# EAGLE design Electric+Scheme (EAGLE 9.7.0)
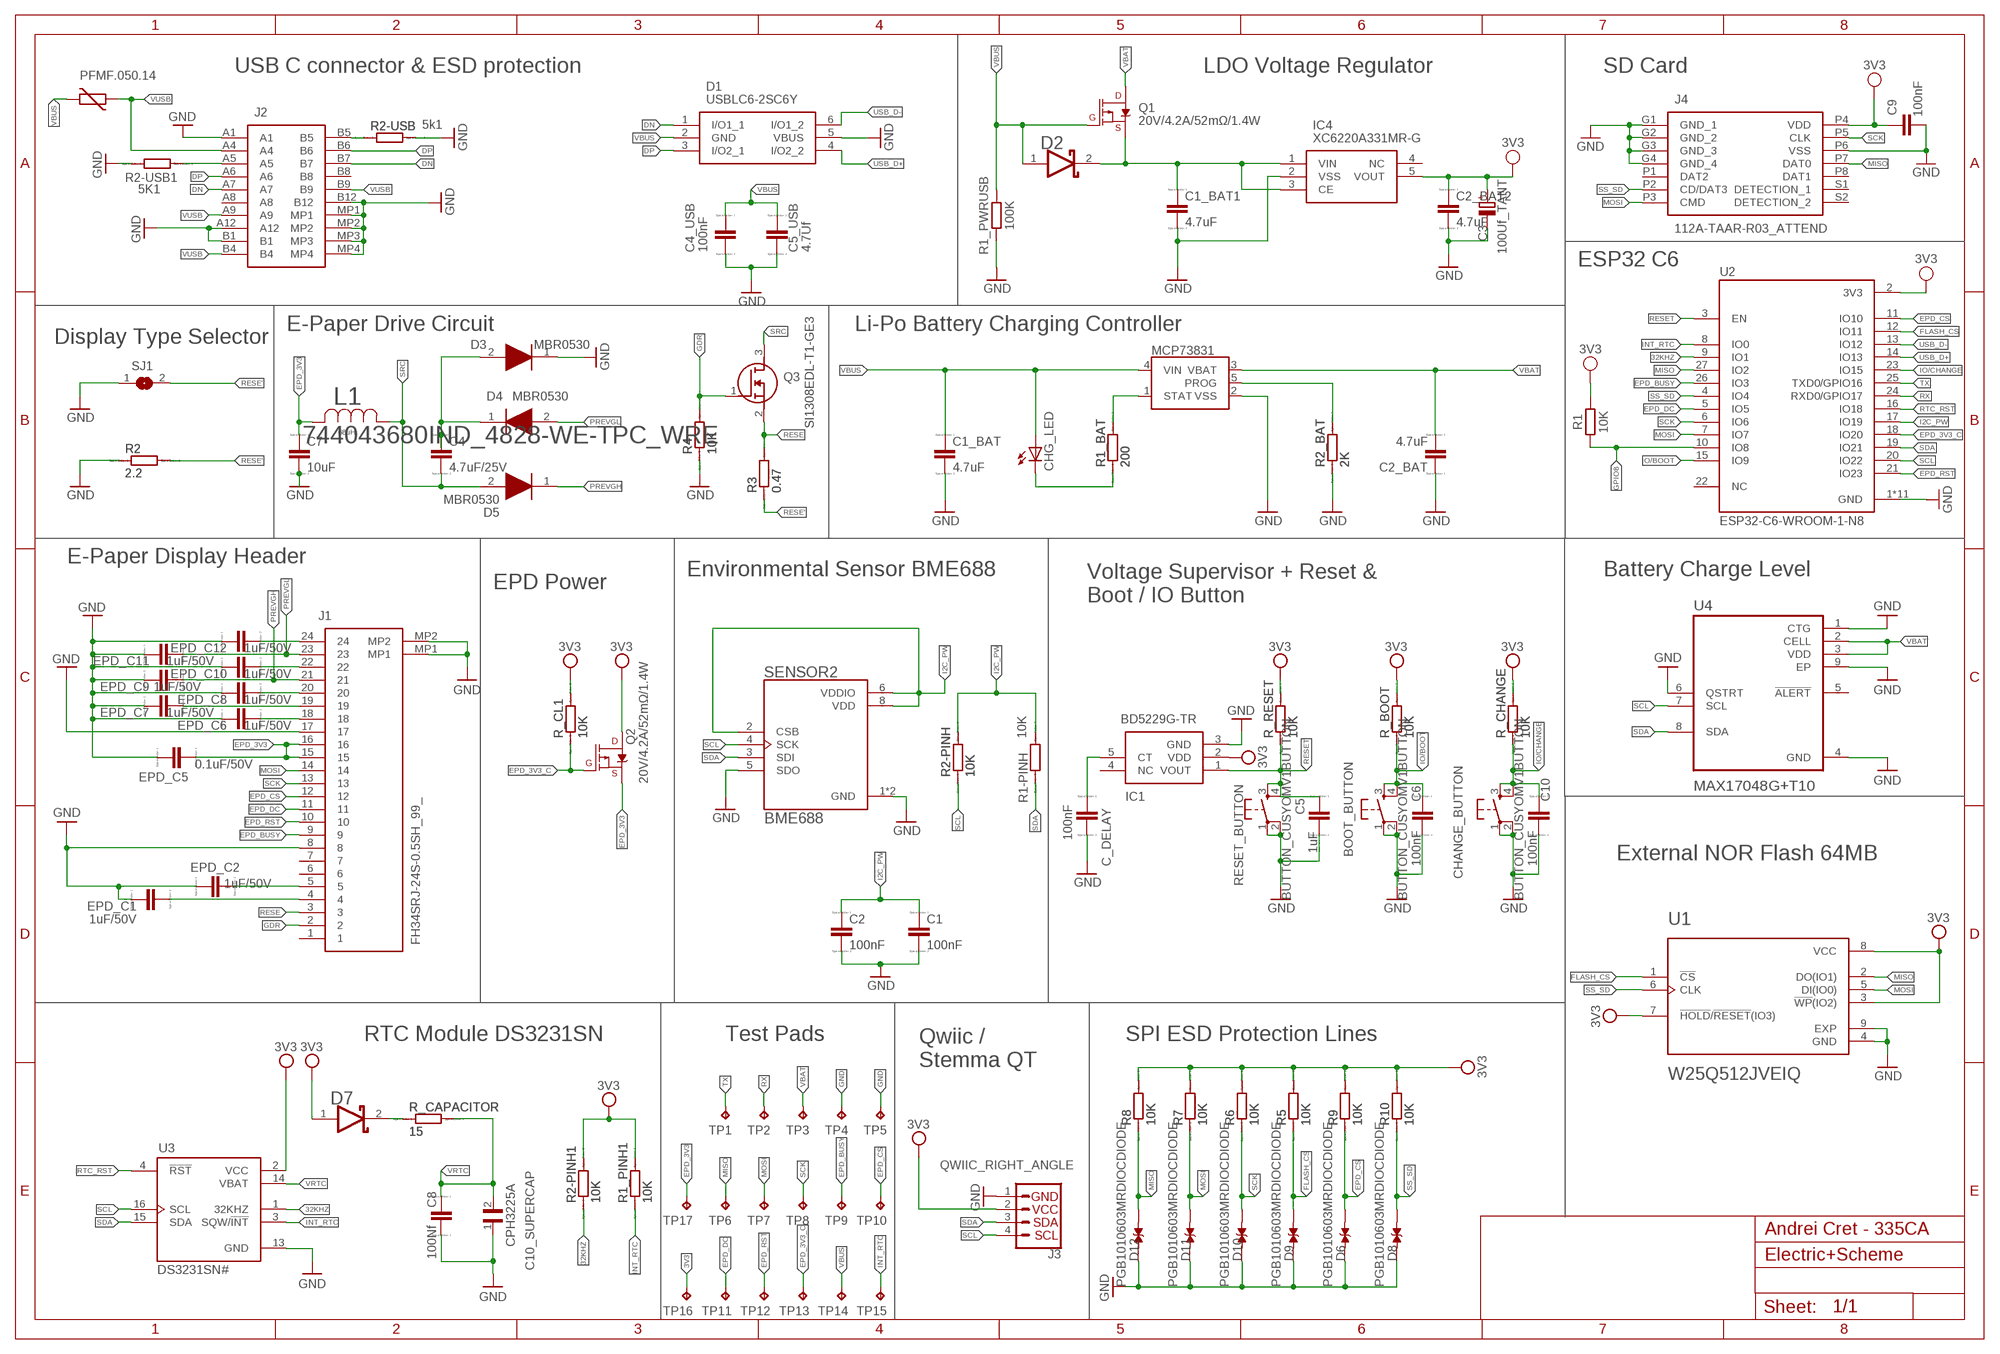
[diagram p0: schematic, sheet 1]

## Parts
BOOT_BUTTON  BUTTON_CUSYOMV1BUTTON  [MYBUTTON]
C1  100nF  EAGLE-LTSPICE_C  [EAGLE-LTSPICE_C0402]
C1_BAT  4.7uF  EAGLE-LTSPICE_C  [EAGLE-LTSPICE_C0402]
C1_BAT1  4.7uF  EAGLE-LTSPICE_C  [EAGLE-LTSPICE_C0402]
C2  100nF  EAGLE-LTSPICE_C  [EAGLE-LTSPICE_C0402]
C2_BAT  4.7uF  EAGLE-LTSPICE_C  [EAGLE-LTSPICE_C0402]
C2_BAT2  4.7uF  EAGLE-LTSPICE_C  [EAGLE-LTSPICE_C0402]
C3  100Uf_TANT  CAPACITOR-POL_TANTALUM-1206(3216-METRIC)  [CAPMP3216X180N]
C4  4.7uF/25V  EAGLE-LTSPICE_C  [EAGLE-LTSPICE_C0402]
C4_USB  100nF  EAGLE-LTSPICE_C  [EAGLE-LTSPICE_C0402]
C5  1uF  EAGLE-LTSPICE_C  [EAGLE-LTSPICE_C0402]
C5_USB  4.7Uf  EAGLE-LTSPICE_C  [EAGLE-LTSPICE_C0402]
C6  100nF  EAGLE-LTSPICE_C  [EAGLE-LTSPICE_C0402]
C7  10uF  EAGLE-LTSPICE_C  [EAGLE-LTSPICE_C0402]
C8  100Nf  ESP32_WROVER_EAGLE-LTSPICE_C  [ESP32_WROVER_EAGLE-LTSPICE_C0402]
C9  100nF  CAPACITOR_CHIP-0402(1005-METRIC)  [CAPC1005X60]
C10  100nF  EAGLE-LTSPICE_C  [EAGLE-LTSPICE_C0402]
C10_SUPERCAP  CPH3225A  [CAPCP3225X100N]
C_DELAY  100nF  EAGLE-LTSPICE_C  [EAGLE-LTSPICE_C0402]
CHANGE_BUTTON  BUTTON_CUSYOMV1BUTTON  [MYBUTTON]
CHG_LED  RED  ADAFRUIT_LEDCHIP-LED0603  [ADAFRUIT_CHIP-LED0603]
D1  USBLC6-2SC6Y  [SOT95P280X145-6N]
D2  ESP32_WROVER_AVX---SD0805S020S1R0_AVX_SD0805S020S1R0_0_0  [ESP32_WROVER_AVX---SD0805S020S1R0_AVX_SD0805S020S1R0_0]
D3  MBR0530  [SOD3716X135N]
D4  MBR0530  [SOD3716X135N]
D5  MBR0530  [SOD3716X135N]
D6  PGB1010603MRDIOCDIODE  [DIOC1608X36N]
D7  ESP32_WROVER_AVX---SD0805S020S1R0_AVX_SD0805S020S1R0_0_0  [ESP32_WROVER_AVX---SD0805S020S1R0_AVX_SD0805S020S1R0_0]
D8  PGB1010603MRDIOCDIODE  [DIOC1608X36N]
D9  PGB1010603MRDIOCDIODE  [DIOC1608X36N]
D10  PGB1010603MRDIOCDIODE  [DIOC1608X36N]
D11  PGB1010603MRDIOCDIODE  [DIOC1608X36N]
D12  PGB1010603MRDIOCDIODE  [DIOC1608X36N]
EPD_C1  1uF/50V  ESP32_WROVER_EAGLE-LTSPICE_C  [ESP32_WROVER_EAGLE-LTSPICE_C0402]
EPD_C2  1uF/50V  ESP32_WROVER_EAGLE-LTSPICE_C  [ESP32_WROVER_EAGLE-LTSPICE_C0402]
EPD_C5  0.1uF/50V  EAGLE-LTSPICE_C  [EAGLE-LTSPICE_C0402]
EPD_C6  1uF/50V  EAGLE-LTSPICE_C  [EAGLE-LTSPICE_C0402]
EPD_C7  1uF/50V  EAGLE-LTSPICE_C  [EAGLE-LTSPICE_C0402]
EPD_C8  1uF/50V  EAGLE-LTSPICE_C  [EAGLE-LTSPICE_C0402]
EPD_C9  1uF/50V  EAGLE-LTSPICE_C  [EAGLE-LTSPICE_C0402]
EPD_C10  1uF/50V  EAGLE-LTSPICE_C  [EAGLE-LTSPICE_C0402]
EPD_C11  1uF/50V  EAGLE-LTSPICE_C  [EAGLE-LTSPICE_C0402]
EPD_C12  1uF/50V  EAGLE-LTSPICE_C  [EAGLE-LTSPICE_C0402]
IC1  BD5229G-TR  [SOT95P280X125-5N]
IC4  XC6220A331MR-G  [SOT95P280X120-5N]
J1  FH34SRJ-24S-0.5SH_99_  [FH34SRJ24S05SH99]
J2  SAMACSYS_PARTS_USB4110-GF-A  [SAMACSYS_PARTS_USB4110GFA]
J3  QWIIC_RIGHT_ANGLE  QWIIC_CONNECTORJS-1MM  [JST04_1MM_RA]
J4  112A-TAAR-R03_ATTEND  [112ATAARR03ATTEND]
L1  744043680IND_4828-WE-TPC_WRE  [IND_4828-WE-TPC_WRE]
MCP73831  ESP32_WROVER_SPARKFUN-IC-POWER_MCP73831  [ESP32_WROVER_SPARKFUN-IC-POWER_SOT23-5]
PFMF.050.14  ESP32C6_VARISTORCN1812  [ESP32C6_VARISTOR_CT/CN1812]
Q1  20V/4.2A/52mΩ/1.4W  ESP32_WROVER_SPARKFUN-DISCRETESEMI_MOSFET_PCH-DMG2305UX-7  [ESP32_WROVER_SPARKFUN-DISCRETESEMI_SOT23-3]
Q2  20V/4.2A/52mΩ/1.4W  ESP32_WROVER_SPARKFUN-DISCRETESEMI_MOSFET_PCH-DMG2305UX-7  [ESP32_WROVER_SPARKFUN-DISCRETESEMI_SOT23-3]
Q3  SI1308EDL-T1-GE3  [SOT65P210X110-3N]
R1  10K  RESISTOR__CHIP-0402(1005-METRIC)  [RESC1005X40]
R1-PINH  10K  ESP32_WROVER_EAGLE-LTSPICE_R  [ESP32_WROVER_EAGLE-LTSPICE_R0402]
R1_BAT  200  ESP32_WROVER_EAGLE-LTSPICE_R  [ESP32_WROVER_EAGLE-LTSPICE_R0402]
R1_PINH1  10K  ESP32_WROVER_EAGLE-LTSPICE_R  [ESP32_WROVER_EAGLE-LTSPICE_R0402]
R1_PWRUSB  100K  RESISTOR__CHIP-0402(1005-METRIC)  [RESC1005X40]
R2  2.2  ESP32_WROVER_EAGLE-LTSPICE_R  [ESP32_WROVER_EAGLE-LTSPICE_R0402]
R2-PINH  10K  ESP32_WROVER_EAGLE-LTSPICE_R  [ESP32_WROVER_EAGLE-LTSPICE_R0402]
R2-PINH1  10K  ESP32_WROVER_EAGLE-LTSPICE_R  [ESP32_WROVER_EAGLE-LTSPICE_R0402]
R2-USB  5k1  ESP32_WROVER_EAGLE-LTSPICE_R  [ESP32_WROVER_EAGLE-LTSPICE_R0402]
R2-USB1  5K1  ESP32_WROVER_EAGLE-LTSPICE_R  [ESP32_WROVER_EAGLE-LTSPICE_R0402]
R2_BAT  2K  ESP32_WROVER_EAGLE-LTSPICE_R  [ESP32_WROVER_EAGLE-LTSPICE_R0402]
R3  0.47  ESP32_WROVER_EAGLE-LTSPICE_R  [ESP32_WROVER_EAGLE-LTSPICE_R0402]
R4  10K  ESP32_WROVER_EAGLE-LTSPICE_R  [ESP32_WROVER_EAGLE-LTSPICE_R0402]
R5  10K  ESP32_WROVER_EAGLE-LTSPICE_R  [ESP32_WROVER_EAGLE-LTSPICE_R0402]
R6  10K  ESP32_WROVER_EAGLE-LTSPICE_R  [ESP32_WROVER_EAGLE-LTSPICE_R0402]
R7  10K  ESP32_WROVER_EAGLE-LTSPICE_R  [ESP32_WROVER_EAGLE-LTSPICE_R0402]
R8  10K  ESP32_WROVER_EAGLE-LTSPICE_R  [ESP32_WROVER_EAGLE-LTSPICE_R0402]
R9  10K  ESP32_WROVER_EAGLE-LTSPICE_R  [ESP32_WROVER_EAGLE-LTSPICE_R0402]
R10  10K  ESP32_WROVER_EAGLE-LTSPICE_R  [ESP32_WROVER_EAGLE-LTSPICE_R0402]
R_BOOT  10K  ESP32_WROVER_EAGLE-LTSPICE_R  [ESP32_WROVER_EAGLE-LTSPICE_R0402]
R_CAPACITOR  15  ESP32_WROVER_EAGLE-LTSPICE_R  [ESP32_WROVER_EAGLE-LTSPICE_R0402]
R_CHANGE  10K  ESP32_WROVER_EAGLE-LTSPICE_R  [ESP32_WROVER_EAGLE-LTSPICE_R0402]
R_CL1  10K  ESP32_WROVER_EAGLE-LTSPICE_R  [ESP32_WROVER_EAGLE-LTSPICE_R0402]
R_RESET  10K  ESP32_WROVER_EAGLE-LTSPICE_R  [ESP32_WROVER_EAGLE-LTSPICE_R0402]
RESET_BUTTON  BUTTON_CUSYOMV1BUTTON  [MYBUTTON]
SENSOR2  BME688  ESP32_WROVER_BME680_BME680  [ESP32_WROVER_BME680_PSON80P300X300X100-8N]
SJ1  SOLDERJUMPER  SJ  [SJ]
TP1  TP  [TP20R]
TP2  TP  [TP20R]
TP3  TP  [TP20R]
TP4  TP  [TP20R]
TP5  TP  [TP20R]
TP6  TP  [TP20R]
TP7  TP  [TP20R]
TP8  TP  [TP20R]
TP9  TP  [TP20R]
TP10  TP  [TP20R]
TP11  TP  [TP20R]
TP12  TP  [TP20R]
TP13  TP  [TP20R]
TP14  TP  [TP20R]
TP15  TP  [TP20R]
TP16  TP  [TP20R]
TP17  TP  [TP20R]
U1  W25Q512JVEIQ  [SON127P600X800X80-9N]
U2  ESP32-C6-WROOM-1-N8  [XCVR_ESP32-C6-WROOM-1-N8]
U3  DS3231SN#  [SOIC127P1032X265-16N]
U4  MAX17048G+T10  [SON50P200X200X80-9N]

## Nets
3V3 [0.3]: C2_BAT2.1 C3.1(+) C9.2 D7.1(ANODE) IC1.2(VDD) IC4.5(VOUT) J3.2 J4.P4(VDD) Q2.3(D) R1.2 R1_PINH1.2 R2-PINH1.2 R5.2 R6.2 R7.2 R8.2 R9.2 R10.2 R_BOOT.2 R_CHANGE.2 R_CL1.2 R_RESET.2 TP16.TP U1.3(!WP!(IO2)) U1.7(!HOLD!/!RESET!(IO3)) U1.8(VCC) U2.2(3V3) U3.2(VCC)
32KHZ: R2-PINH1.1 U2.9(IO1) U3.1(32KHZ)
DN: D1.1(I/O1_1) J2.A7 J2.B7
DP: D1.3(I/O2_1) J2.A6 J2.B6
EPD_3V3 [0.3]: C7.1 EPD_C5.2 J1.15 J1.16 L1.2 Q2.2(S) TP17.TP
EPD_3V3_C [0.3]: Q2.1(G) R_CL1.1 TP13.TP U2.18(IO20)
EPD_BUSY: J1.9 TP9.TP U2.26(IO3)
EPD_CS: D6.2 J1.12 R9.1 TP10.TP U2.11(IO10)
EPD_DC: J1.11 TP11.TP U2.5(IO5)
EPD_RST: J1.10 TP12.TP U2.21(IO23)
FLASH_CS: D9.2 R5.1 U1.1(!CS) U2.12(IO11)
GDR [0.3]: J1.2 Q3.1(G) R4.2
GND [0.3]: BOOT_BUTTON.1 BOOT_BUTTON.2 C1.2 C1_BAT1.2 C1_BAT.2 C2.2 C2_BAT2.2 C2_BAT.1 C3.2(-) C4_USB.2 C5.2 C5_USB.2 C6.2 C7.2 C8.2 C9.1 C10.2 C10_SUPERCAP.1 C_DELAY.2 CHANGE_BUTTON.1 CHANGE_BUTTON.2 D1.5(VBUS) D3.1(K) D6.1 D8.1 D9.1 D10.1 D11.1 D12.1 EPD_C1.1 EPD_C2.1 EPD_C5.1 EPD_C6.1 EPD_C7.1 EPD_C8.1 EPD_C9.1 EPD_C10.1 EPD_C11.1 EPD_C12.1 IC1.3(GND) IC4.2(VSS) J1.8 J1.17 J1.MP1 J1.MP2 J2.A1 J2.A12 J2.B1 J2.B12 J2.MP1 J2.MP2 J2.MP3 J2.MP4 J3.1 J4.G1(GND_1) J4.G2(GND_2) J4.G3(GND_3) J4.G4(GND_4) J4.P6(VSS) MCP73831.2(VSS) R1_PWRUSB.1 R2-USB1.1 R2-USB.2 R2.1 R2_BAT.1 R4.1 RESET_BUTTON.1 RESET_BUTTON.2 SENSOR2.1(GND) SENSOR2.5(SDO) SENSOR2.7(GND) SJ1.1 TP4.TP TP5.TP U1.4(GND) U1.9(EXP) U2.1(GND) U2.28(GND) U2.29_1(GND) U2.29_2(GND) U2.29_3(GND) U2.29_4(GND) U2.29_5(GND) U2.29_6(GND) U2.29_7(GND) U2.29_8(GND) U2.29_9(GND) U3.13(GND) U4.1(CTG) U4.4(GND) U4.6(QSTRT) U4.9(EP)
GPIO8: R1.1 U2.10(IO8)
I2C_PW [0.3]: C1.1 C2.1 R1-PINH.2 R2-PINH.2 SENSOR2.2(CSB) SENSOR2.6(VDDIO) SENSOR2.8(VDD) U2.17(IO19)
INT_RTC: R1_PINH1.1 TP15.TP U2.8(IO0) U3.3(SQW/!INT)
IO/BOOT: BOOT_BUTTON.3 BOOT_BUTTON.4 C6.1 R_BOOT.1 U2.15(IO9)
IO/CHANGE: C10.1 CHANGE_BUTTON.3 CHANGE_BUTTON.4 R_CHANGE.1 U2.23(IO15)
MISO: D12.2 J4.P7(DAT0) R8.1 TP6.TP U1.2(DO(IO1)) U2.27(IO2)
MOSI: D11.2 J1.14 J4.P3(CMD) R7.1 TP7.TP U1.5(DI(IO0)) U2.7(IO7)
N$1: C1_BAT1.1 D2.2(CATHODE) IC4.1(VIN) IC4.3(CE) Q1.2(S)
N$3: C4.1 D3.2(A) D4.1(K)
N$4: J2.B5 R2-USB.1
N$5: MCP73831.1(STAT) R1_BAT.2
N$6: CHG_LED.C R1_BAT.1
N$8: MCP73831.5(PROG) R2_BAT.2
N$9: D7.2(CATHODE) R_CAPACITOR.1
N$10: J2.A5 R2-USB1.2
N$11: EPD_C2.2 J1.5
N$12: EPD_C1.2 J1.4
N$13: D8.2 R10.1
N$14: C_DELAY.1 IC1.5(CT)
N$15 [0.3]: EPD_C12.2 J1.24
N$16: EPD_C6.2 J1.18
N$17: EPD_C7.2 J1.19
N$18: EPD_C10.2 J1.22
N$20: EPD_C8.2 J1.20
PREVGH: D5.1(K) EPD_C9.2 J1.21
PREVGL [0.3]: D4.2(A) EPD_C11.2 J1.23
RESE: J1.3 Q3.2(S) R3.2
RESE': R2.2 R3.1 SJ1.2
RESET: C5.1 IC1.1(VOUT) R_RESET.1 RESET_BUTTON.3 RESET_BUTTON.4 U2.3(EN)
RTC_RST: U2.16(IO18) U3.4(!RST)
RX: TP2.TP U2.24(RXD0/GPIO17)
SCK: D10.2 J1.13 J4.P5(CLK) R6.1 TP8.TP U2.6(IO6)
SCL: J3.4 R2-PINH.1 SENSOR2.4(SCK) U2.20(IO22) U3.16(SCL) U4.7(SCL)
SDA: J3.3 R1-PINH.1 SENSOR2.3(SDI) U2.19(IO21) U3.15(SDA) U4.8(SDA)
SRC: C4.2 D5.2(A) L1.1 Q3.3(D)
SS_SD: J4.P2(CD/DAT3) U1.6(CLK) U2.4(IO4)
TX: TP1.TP U2.25(TXD0/GPIO16)
USB_D+: D1.4(I/O2_2) U2.14(IO13)
USB_D-: D1.6(I/O1_2) U2.13(IO12)
VBAT [0.3]: C2_BAT.2 MCP73831.3(VBAT) Q1.3(D) TP3.TP U4.2(CELL) U4.3(VDD)
VBUS [0.3]: C1_BAT.1 C4_USB.1 C5_USB.1 CHG_LED.A D1.2(GND) D2.1(ANODE) MCP73831.4(VIN) PFMF.050.14.2 Q1.1(G) R1_PWRUSB.2 TP14.TP
VRTC: C8.1 C10_SUPERCAP.2 R_CAPACITOR.2 U3.14(VBAT)
VUSB [0.3]: J2.A4 J2.A9 J2.B4 J2.B9 PFMF.050.14.1
Unconnected: IC1.4(NC) IC4.4(NC) J1.1 J1.6 J1.7 J2.A8 J2.B8 J4.P1(DAT2) J4.P8(DAT1) J4.S1(DETECTION_1) J4.S2(DETECTION_2) U2.22(NC) U4.5(!ALERT)

## Notes on the sheet
- USB C connector & ESD protection | LDO Voltage Regulator | SD Card
- ESP32 C6
- E-Paper Drive Circuit | Li-Po Battery Charging Controller
- Display Type Selector
- E-Paper Display Header
- Environmental Sensor BME688 | Battery Charge Level
- EPD Power
- Voltage Supervisor + Reset & 
  Boot / IO Button
- External NOR Flash 64MB
- RTC Module DS3231SN | Test Pads | SPI ESD Protection Lines
- Qwiic /
  Stemma QT
- Andrei Cret - 335CA

## Library data of the parts
BOOT_BUTTON CHANGE_BUTTON RESET_BUTTON = DeskAssistant v19 v1:BUTTON_CUSYOMV1
C1 C1_BAT C1_BAT1 C2 C2_BAT C2_BAT2 C4 C4_USB C5 C5_USB C6 C7 C10 C_DELAY EPD_C5-EPD_C12 = DeskAssistant v19 v1:EAGLE-LTSPICE_C: CAPACITOR, European symbol
C3 = Tinkercad:CAPACITOR-POL: Capacitor Polarised - Generic; CATEGORY: Capacitor
C8 EPD_C1 EPD_C2 = DeskAssistant v19 v1:ESP32_WROVER_EAGLE-LTSPICE_C: CAPACITOR, European symbol
C9 = Tinkercad:CAPACITOR: Capacitor - Generic; CATEGORY: Capacitor
C10_SUPERCAP = DeskAssistant v19 v1:CPH3225A: Cap 0.011F 3.3V 1210 Flat Check availability <https://pricing.snapeda.com/parts/CPH3225A/Seiko%20Instruments/view-part?ref=eda>; AVAILABILITY: Not in stock; CHECK_PRICES: https://www.snapeda.com/parts/CPH3225A/Seiko+Instruments/view-part/?ref=eda; DESCRIPTION: 11 mF (EDLC) Supercapacitor 3.3 V 1210 (3225 Metric) - -; MF: Seiko Instruments; MP: CPH3225A; PACKAGE: 1210 Seiko; PRICE: None; PURCHASE-URL: https://www.snapeda.com/api/url_track_click_mouser/?unipart_id=562593&manufacturer=Seiko Instruments&part_name=CPH3225A&search_term=None; SNAPEDA_LINK: https://www.snapeda.com/parts/CPH3225A/Seiko+Instruments/view-part/?ref=snap
CHG_LED = DeskAssistant v19 v1:ADAFRUIT_LED: LED OSRAM: - CHIPLED LG R971, LG N971, LY N971, LG Q971, LY Q971, LO R971, LY R971 LH N974, LH R974 LS Q976, LO Q976, LY Q976 LO Q996 - Hyper CHIPLED LW Q18S LB Q993, LB Q99A, LB R99A - SideLED LS A670, LO A670, LY A670, LG A670, LP A670 LB A673, LV A673, LT A673, LW A673 LH A674 LY A675 LS A676, LA A676, LO A676, LY A676, LW A676 LS A679, LY A679, LG A679 - Hyper Micro SIDELED® LS Y876, LA Y876, LO Y876, LY Y876 LT Y87S - SmartLED LW L88C, LW L88S LB L89C, LB L89S, LG L890 LS L89K, LO L89K, LY L89K LS L896, LA L896, LO L896, LY L896 - TOPLED LS T670, LO T670, LY T670, LG T670, LP T670 LSG T670, LSP T670, LSY T670, LOP T670, LYG T670 LG T671, LOG T671, LSG T671 LB T673, LV T673, LT T673, LW T673 LH T674 LS T676, LA T676, LO T676, LY T676, LB T676, LH T676, LSB T676, LW T676 LB T67C, LV T67C, LT T67C, LS T67K, LO T67K, LY T67K, LW E67C LS E67B, LA E67B, LO E67B, LY E67B, LB E67C, LV E67C, LT E67C LW T67C LS T679, LY T679, LG T679 LS T770, LO T770, LY T770, LG T770, LP T770 LB T773, LV T773, LT T773, LW T773 LH T774 LS E675, LA E675, LY E675, LS T675 LS T776, LA T776, LO T776, LY T776, LB T776 LHGB T686 LT T68C, LB T68C - Hyper Mini TOPLED® LB M676 - Mini TOPLED Santana® LG M470 LS M47K, LO M47K, LY M47K Source: http://www.osram.convergy.de/
D1 = DeskAssistant v19 v1:USBLC6-2SC6Y: Low Cap. ESD Protection Auto SOT-23-6 STMicroelectronics USBLC6-2SC6Y, Dual Uni-Directional TVS Diode Array, 6-Pin SOT-23 Source: Datasheet <https://componentsearchengine.com/Datasheets/1/USBLC6-2SC6Y.pdf> Check availability <https://pricing.snapeda.com/parts/USBLC6-2SC6Y/STMicroelectronics/view-part?ref=eda>; AVAILABILITY: In Stock; CHECK_PRICES: https://www.snapeda.com/parts/USBLC6-2SC6Y/STMicroelectronics/view-part/?ref=eda; DESCRIPTION: 17V Clamp 5A (8/20µs) Ipp Tvs Diode Surface Mount SOT-23-6; MF: STMicroelectronics; MP: USBLC6-2SC6Y; PACKAGE: SOT-23-6 STMicroelectronics; PRICE: None; SNAPEDA_LINK: https://www.snapeda.com/parts/USBLC6-2SC6Y/STMicroelectronics/view-part/?ref=snap
D2 D7 = DeskAssistant v19 v1:ESP32_WROVER_AVX---SD0805S020S1R0_AVX_SD0805S020S1R0_0_0: Schottky Barrier Rectifier Diode
D3-D5 = DeskAssistant v19 v1:MBR0530: ON SEMICONDUCTOR - MBR0530 - DIODE, SCHOTTKY, 0.5A, 30V, SOD-123 Source: Datasheet <http://www.onsemi.com/pub/Collateral/MBR0530T1-D.PDF> Check availability <https://pricing.snapeda.com/parts/MBR0530/ON%20Semiconductor/view-part?ref=eda>
D6 D8-D12 = DeskAssistant v19 v1:PGB1010603MR: Check availability <https://pricing.snapeda.com/parts/PGB1010603MR/Littelfuse%20Inc./view-part?ref=eda>
IC1 = DeskAssistant v19 v1:BD5229G-TR: Voltage Detector with Adjustable Delay Time: CMOS processes are utilized to develop high precision, low current consumption CMOS reset ICs that allow arbitrary setting of the delay time. The extensive lineup includes both Nch Open Drain and CMOS output types in a wide range of detection voltages (from 2.3V to 6.0V, in 0.1V steps), enabling selection of the ideal solution based on customer requirements. In addition, the entire series is of course both lead-free and RoHS-compliant. Source: Datasheet <https://datasheet.datasheetarchive.com/originals/distributors/Datasheets_SAMA/f2b9741ef86007909f138d561a359946.pdf>; DESCRIPTION: Voltage Detector with Adjustable Delay Time: CMOS processes are utilized to develop high precision, low current consumption CMOS reset ICs that allow arbitrary setting of the delay time. The extensive lineup includes both Nch Open Drain and CMOS output types in a wide range of detection voltages (from 2.3V to 6.0V, in 0.1V steps), enabling selection of the ideal solution based on customer requirements. In addition, the entire series is of course both lead-free and RoHS-compliant.; HEIGHT: 1.25mm; MANUFACTURER_NAME: ROHM Semiconductor; MANUFACTURER_PART_NUMBER: BD5229G-TR; MOUSER_PART_NUMBER: 755-BD5229G-TR; MOUSER_PRICE-STOCK: https://www.mouser.co.uk/ProductDetail/ROHM-Semiconductor/BD5229G-TR?qs=4kLU8WoGk0vvnhrrYwdszw%3D%3D
IC4 = DeskAssistant v19 v1:XC6220A331MR-G: LDO Voltage Regulators Source: Datasheet <https://www.torexsemi.com/file/xc6220/XC6220.pdf>; DESCRIPTION: LDO Voltage Regulators; HEIGHT: 1.2mm; MANUFACTURER_NAME: Torex; MANUFACTURER_PART_NUMBER: XC6220A331MR-G; MOUSER_PART_NUMBER: 865-XC6220A331MR-G; MOUSER_PRICE-STOCK: https://www.mouser.co.uk/ProductDetail/Torex-Semiconductor/XC6220A331MR-G?qs=AsjdqWjXhJ8ZSWznL1J0gg%3D%3D
J1 = DeskAssistant v19 v1:FH34SRJ-24S-0.5SH_99_: 24 Position FFC, FPC Connector Contacts, Top and Bottom 0.020" (0.50mm) Surface Mount, Right Angle Source: Datasheet <https://www.hirose.com/en/product/document?clcode=CL0580-1255-6-99&productname=FH34SRJ-24S-0.5SH(99)&series=FH34SRJ&documenttype=2DDrawing&lang=en&documentid=0000990903>; DESCRIPTION: 24 Position FFC, FPC Connector Contacts, Top and Bottom 0.020" (0.50mm) Surface Mount, Right Angle; HEIGHT: 1.1mm; MANUFACTURER_NAME: Hirose; MANUFACTURER_PART_NUMBER: FH34SRJ-24S-0.5SH(99); MOUSER_PART_NUMBER: 798-FH34SRJ24S05SH99; MOUSER_PRICE-STOCK: https://www.mouser.co.uk/ProductDetail/Hirose-Connector/FH34SRJ-24S-0.5SH99?qs=vcbW%252B4%252BSTIpKBl5ap9J8Fw%3D%3D
J2 = DeskAssistant v19 v1:SAMACSYS_PARTS_USB4110-GF-A: CONN USB 2.0 TYPE-C R/A SMT Source: Datasheet <https://gct.co/files/drawings/usb4110.pdf>; DESCRIPTION: CONN USB 2.0 TYPE-C R/A SMT; HEIGHT: 3.26mm; MANUFACTURER_NAME: GCT (GLOBAL CONNECTOR TECHNOLOGY); MANUFACTURER_PART_NUMBER: USB4110-GF-A; MOUSER_PART_NUMBER: 640-USB4110-GF-A; MOUSER_PRICE-STOCK: https://www.mouser.co.uk/ProductDetail/GCT/USB4110-GF-A?qs=KUoIvG%2F9IlYiZvIXQjyJeA%3D%3D
J3 = DeskAssistant v19 v1:QWIIC_CONNECTOR: SparkFun I2C Standard Qwiic Connector An SMD 1mm pitch JST connector makes it easy and quick (get it? Qwiic?) to connect I2C devices to each other. The Qwiic system <http://www.sparkfun.com/qwiic> enables fast and solderless connection between popular platforms and various sensors and actuators. We carry 200mm <https://www.sparkfun.com/products/14204>, 100mm <https://www.sparkfun.com/products/14205>, 50mm <https://www.sparkfun.com/products/14206>, and breadboard friendly <https://www.sparkfun.com/products/14207> Qwiic cables. We also offer 10 pcs strips <https://www.sparkfun.com/products/14323> the SMD connectors.; PROD_ID: CONN-13694
J4 = DeskAssistant v19 v1:112A-TAAR-R03_ATTEND: Micro SD Card Socket, Push-Push Type, Top Mount, SMT, H=1.83mm, 10u Source: Datasheet <https://www.attend.com.tw/data/download/file/112A-TAAR-R03.pdf>; DESCRIPTION: Micro SD Card Socket, Push-Push Type, Top Mount, SMT, H=1.83mm, 10u; HEIGHT: 1.9mm; MANUFACTURER_NAME: ATTEND; MANUFACTURER_PART_NUMBER: 112A-TAAR-R03 ATTEND
L1 = DeskAssistant v19 v1:744043680; COPYRIGHT: Copyright (C) 2024 Ultra Librarian. All rights reserved.; ETC: 68uH; MANUFACTURER_PART_NUMBER: 744043680; MFR_NAME: Wurth Electronics
MCP73831 = DeskAssistant v19 v1:ESP32_WROVER_SPARKFUN-IC-POWER_MCP73831: MCP73831T Li-Ion, Li-Pol Controller Miniature single cell, fully integrated Li-Ion, Li-polymer charge management controller Datasheet <http://ww1.microchip.com/downloads/en/DeviceDoc/20001984g.pdf> SparkFun Products: SparkFun ESP32 Thing <https://www.sparkfun.com/products/13907> SparkFun 9DoF Razor IMU M0 <https://www.sparkfun.com/products/14001>; PROD_ID: IC-09995
PFMF.050.14 = DeskAssistant v19 v1:ESP32C6_VARISTOR: VARISTOR
Q1 Q2 = DeskAssistant v19 v1:ESP32_WROVER_SPARKFUN-DISCRETESEMI_MOSFET_PCH: P-channel MOSFETs Voltage controlled devices that allow control of high current outputs. SparkFun Products: SparkFun ESP32 Thing <https://www.sparkfun.com/products/13907> SparkFun ESP8266 Thing <https://www.sparkfun.com/products/13231> SparkFun Pi Servo HAT V2 <https://www.sparkfun.com/products/15316> DMG2305UX-7 (20V/4.2A/SOT23-3); PROD_ID: TRAN-14388
Q3 = DeskAssistant v19 v1:SI1308EDL-T1-GE3: MOSFET N-Ch 30V 1.5A TrenchFET SC70 Vishay Si1308EDL-T1-GE3 N-channel MOSFET Transistor, 1.5 A, 30 V, 3-Pin SC-70 Source: Datasheet <https://componentsearchengine.com/Datasheets/1/SI1308EDL-T1-GE3.pdf> Check availability <https://pricing.snapeda.com/parts/SI1308EDL-T1-GE3/Vishay%20Siliconix/view-part?ref=eda>; AVAILABILITY: In Stock; CHECK_PRICES: https://www.snapeda.com/parts/SI1308EDL-T1-GE3/Vishay+Siliconix/view-part/?ref=eda; DESCRIPTION: Si1308EDL-T1-GE3 N-channel MOSFET Transistor, 1.5 A, 30 V, 3-Pin SC-70 | Siliconix / Vishay SI1308EDL-T1-GE3; MF: Vishay Siliconix; MP: SI1308EDL-T1-GE3; PACKAGE: SOT-323 Vishay Semiconductor; PRICE: None; PURCHASE-URL: https://www.snapeda.com/api/url_track_click_mouser/?unipart_id=274603&manufacturer=Vishay Siliconix&part_name=SI1308EDL-T1-GE3&search_term=None; SNAPEDA_LINK: https://www.snapeda.com/parts/SI1308EDL-T1-GE3/Vishay+Siliconix/view-part/?ref=snap
R1 R1_PWRUSB = Tinkercad:RESISTOR: Resistor Fixed - Generic; CATEGORY: Resistor; SUB-CATEGORY: Fixed
R1-PINH R1_BAT R1_PINH1 R2 R2-PINH R2-PINH1 R2-USB R2-USB1 R2_BAT R3-R10 R_BOOT R_CAPACITOR R_CHANGE R_CL1 R_RESET = DeskAssistant v19 v1:ESP32_WROVER_EAGLE-LTSPICE_R: RESISTOR, European symbol
SENSOR2 = DeskAssistant v19 v1:ESP32_WROVER_BME680_BME680: Integrated Environmental Unit; AVAILABILITY: Unavailable; DESCRIPTION: Integrated Environmental Unit; MF: Bosch Sensortec; MP: BME680; PACKAGE: LGA-8 Bosch Tools; PRICE: None
SJ1 = DeskAssistant v19 v1:SJ: SMD solder JUMPER
TP1-TP17 = DeskAssistant v19 v1:TP: Test pad
U1 = DeskAssistant v19 v1:W25Q512JVEIQ: Check availability <https://pricing.snapeda.com/parts/W25Q512JVEIQ/Winbond%20Electronics/view-part?ref=eda>; AVAILABILITY: In Stock; CHECK_PRICES: https://www.snapeda.com/parts/W25Q512JVEIQ/Winbond+Electronics/view-part/?ref=eda; DESCRIPTION: FLASH - NOR Memory IC 512Mb (64M x 8) SPI - Quad I/O 133 MHz 8-WSON (8x6); MF: Winbond Electronics; MP: W25Q512JVEIQ; PACKAGE: Package; PRICE: None; SNAPEDA_LINK: https://www.snapeda.com/parts/W25Q512JVEIQ/Winbond+Electronics/view-part/?ref=snap
U2 = DeskAssistant v19 v1:ESP32-C6-WROOM-1-N8: Check availability <https://pricing.snapeda.com/parts/ESP32-C6-WROOM-1-N8/Espressif%20Systems/view-part?ref=eda>; AVAILABILITY: In Stock; CHECK_PRICES: https://www.snapeda.com/parts/ESP32-C6-WROOM-1-N8/Espressif+Systems/view-part/?ref=eda; DESCRIPTION: Multiprotocol Modules ESP32-C6 module, Wi-Fi 6 in 2.4 GHz band, Bluetooth 5, Zigbee 3.0 and Thread. ESP34-WROOM Compatible - ENGINEERING SAMPLE; MF: Espressif Systems; MP: ESP32-C6-WROOM-1-N8; PACKAGE: None; PRICE: None; SNAPEDA_LINK: https://www.snapeda.com/parts/ESP32-C6-WROOM-1-N8/Espressif+Systems/view-part/?ref=snap
U3 = DeskAssistant v19 v1:DS3231SN#: Real Time Clock Serial 16-Pin SOIC W T/R Check availability <https://pricing.snapeda.com/parts/DS3231SN%23/Analog%20Devices/view-part?ref=eda>; AVAILABILITY: In Stock; CHECK_PRICES: https://www.snapeda.com/parts/DS3231SN%23/Analog+Devices/view-part/?ref=eda; DESCRIPTION: Extremely Accurate I²C-Integrated RTC/TCXO/Crystal; MF: Analog Devices; MP: DS3231SN#; PACKAGE: SOIC-16 Maxim; PRICE: None; PURCHASE-URL: https://www.snapeda.com/api/url_track_click_mouser/?unipart_id=99048&manufacturer=Analog Devices&part_name=DS3231SN#&search_term=None; SNAPEDA_LINK: https://www.snapeda.com/parts/DS3231SN%23/Analog+Devices/view-part/?ref=snap
U4 = DeskAssistant v19 v1:MAX17048G+T10: Check availability <https://pricing.snapeda.com/parts/MAX17048G%2BT10/Analog%20Devices/view-part?ref=eda>; AVAILABILITY: In Stock; CHECK_PRICES: https://www.snapeda.com/parts/MAX17048G+T10/Analog+Devices/view-part/?ref=eda; DESCRIPTION: 3µA 1-Cell/2-Cell Fuel Gauge with ModelGauge; MF: Analog Devices; MP: MAX17048G+T10; PACKAGE: TDFN-8 Maxim; PRICE: None; PURCHASE-URL: https://www.snapeda.com/api/url_track_click_mouser/?unipart_id=329239&manufacturer=Analog Devices&part_name=MAX17048G+T10&search_term=None; SNAPEDA_LINK: https://www.snapeda.com/parts/MAX17048G+T10/Analog+Devices/view-part/?ref=snap

## Net classes
1 0.3: width 0.3 mm

## Board
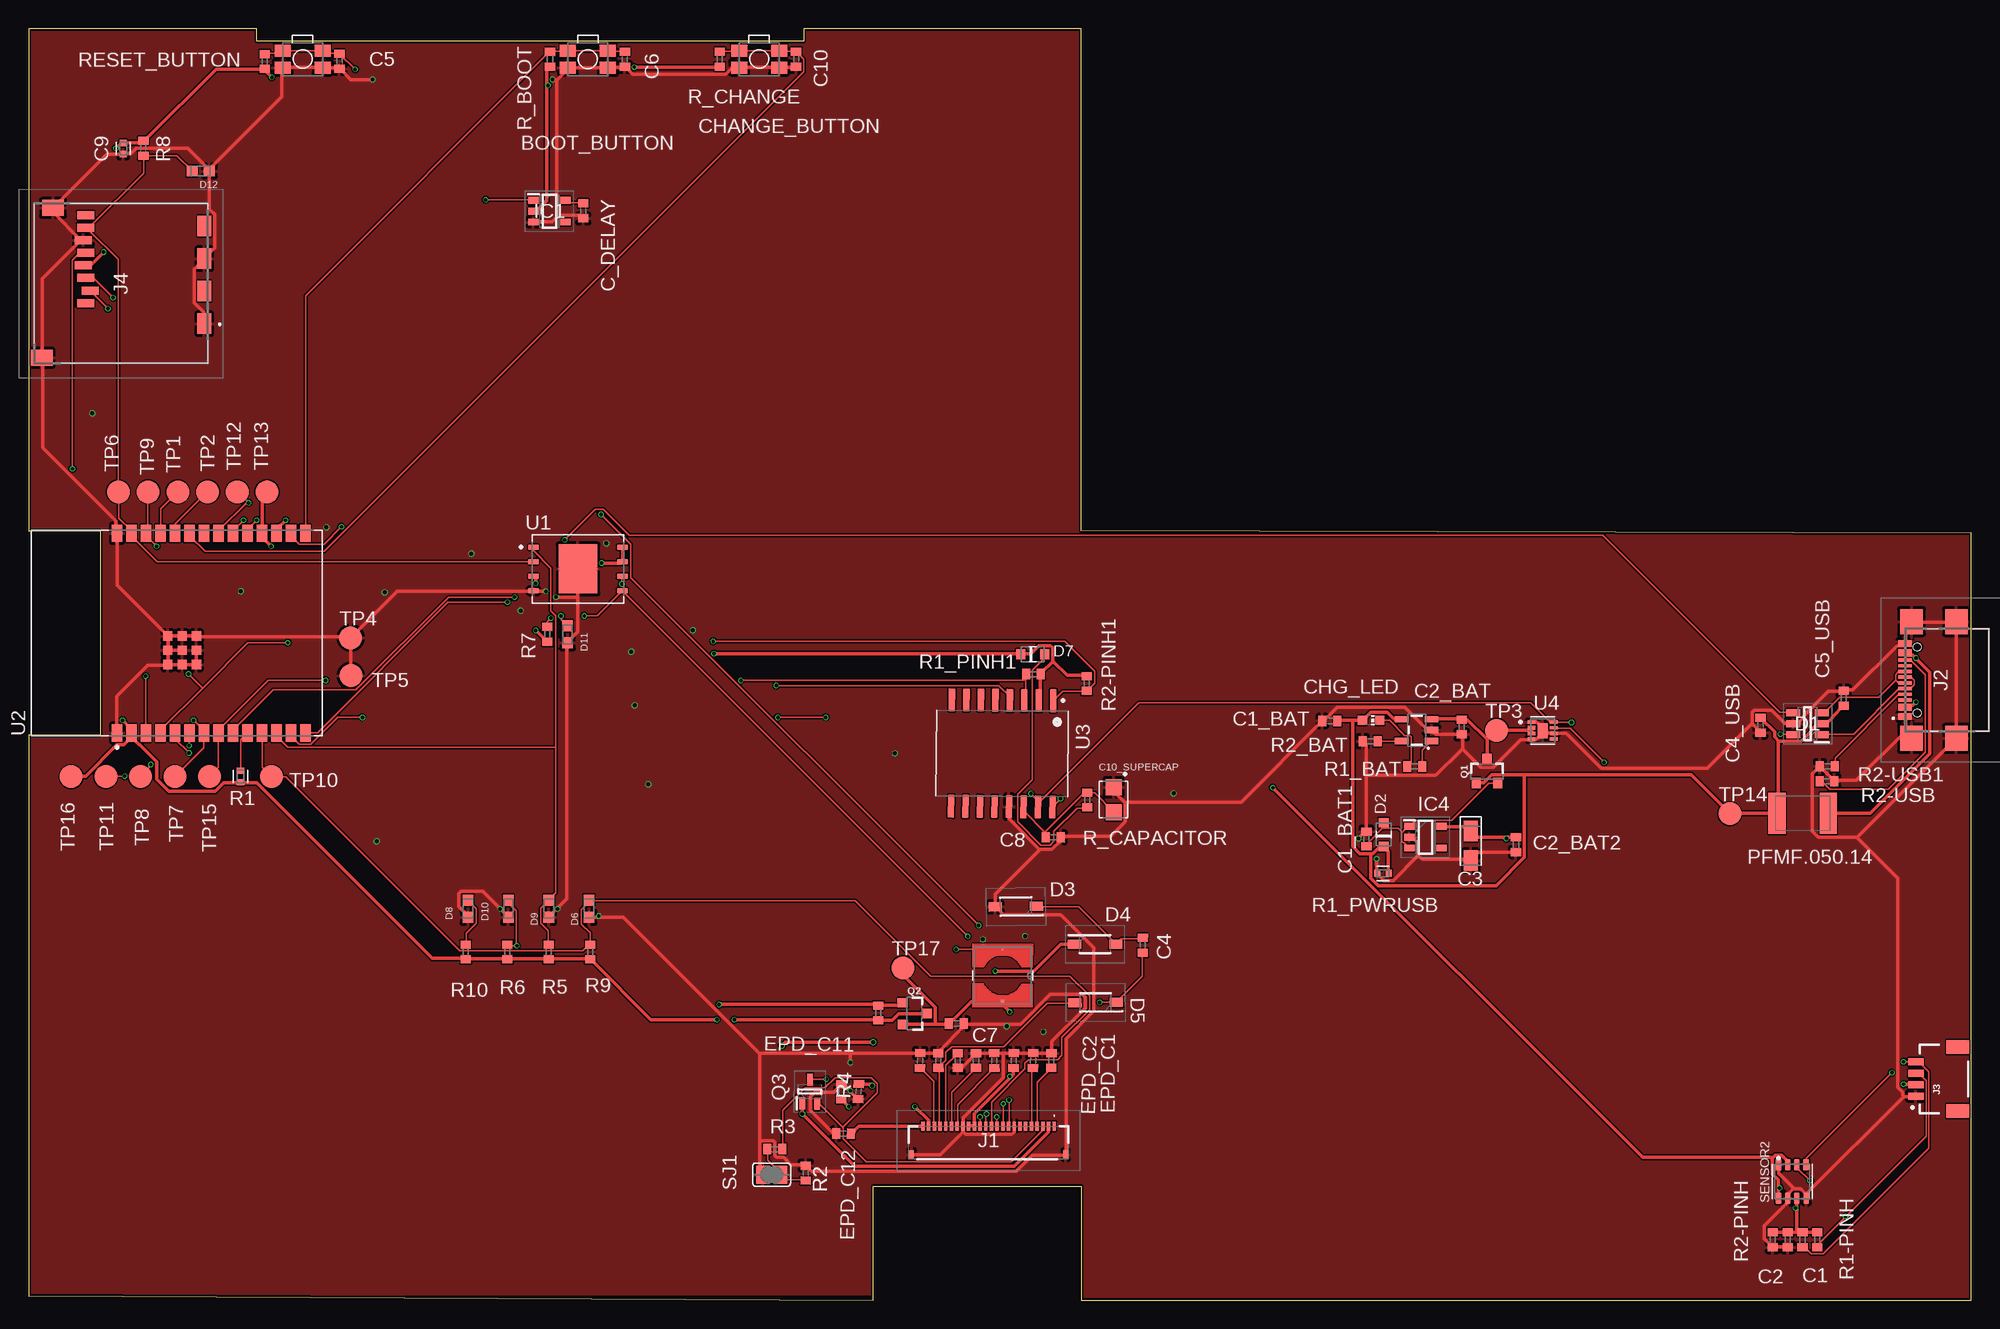
[diagram p1: board, top side]
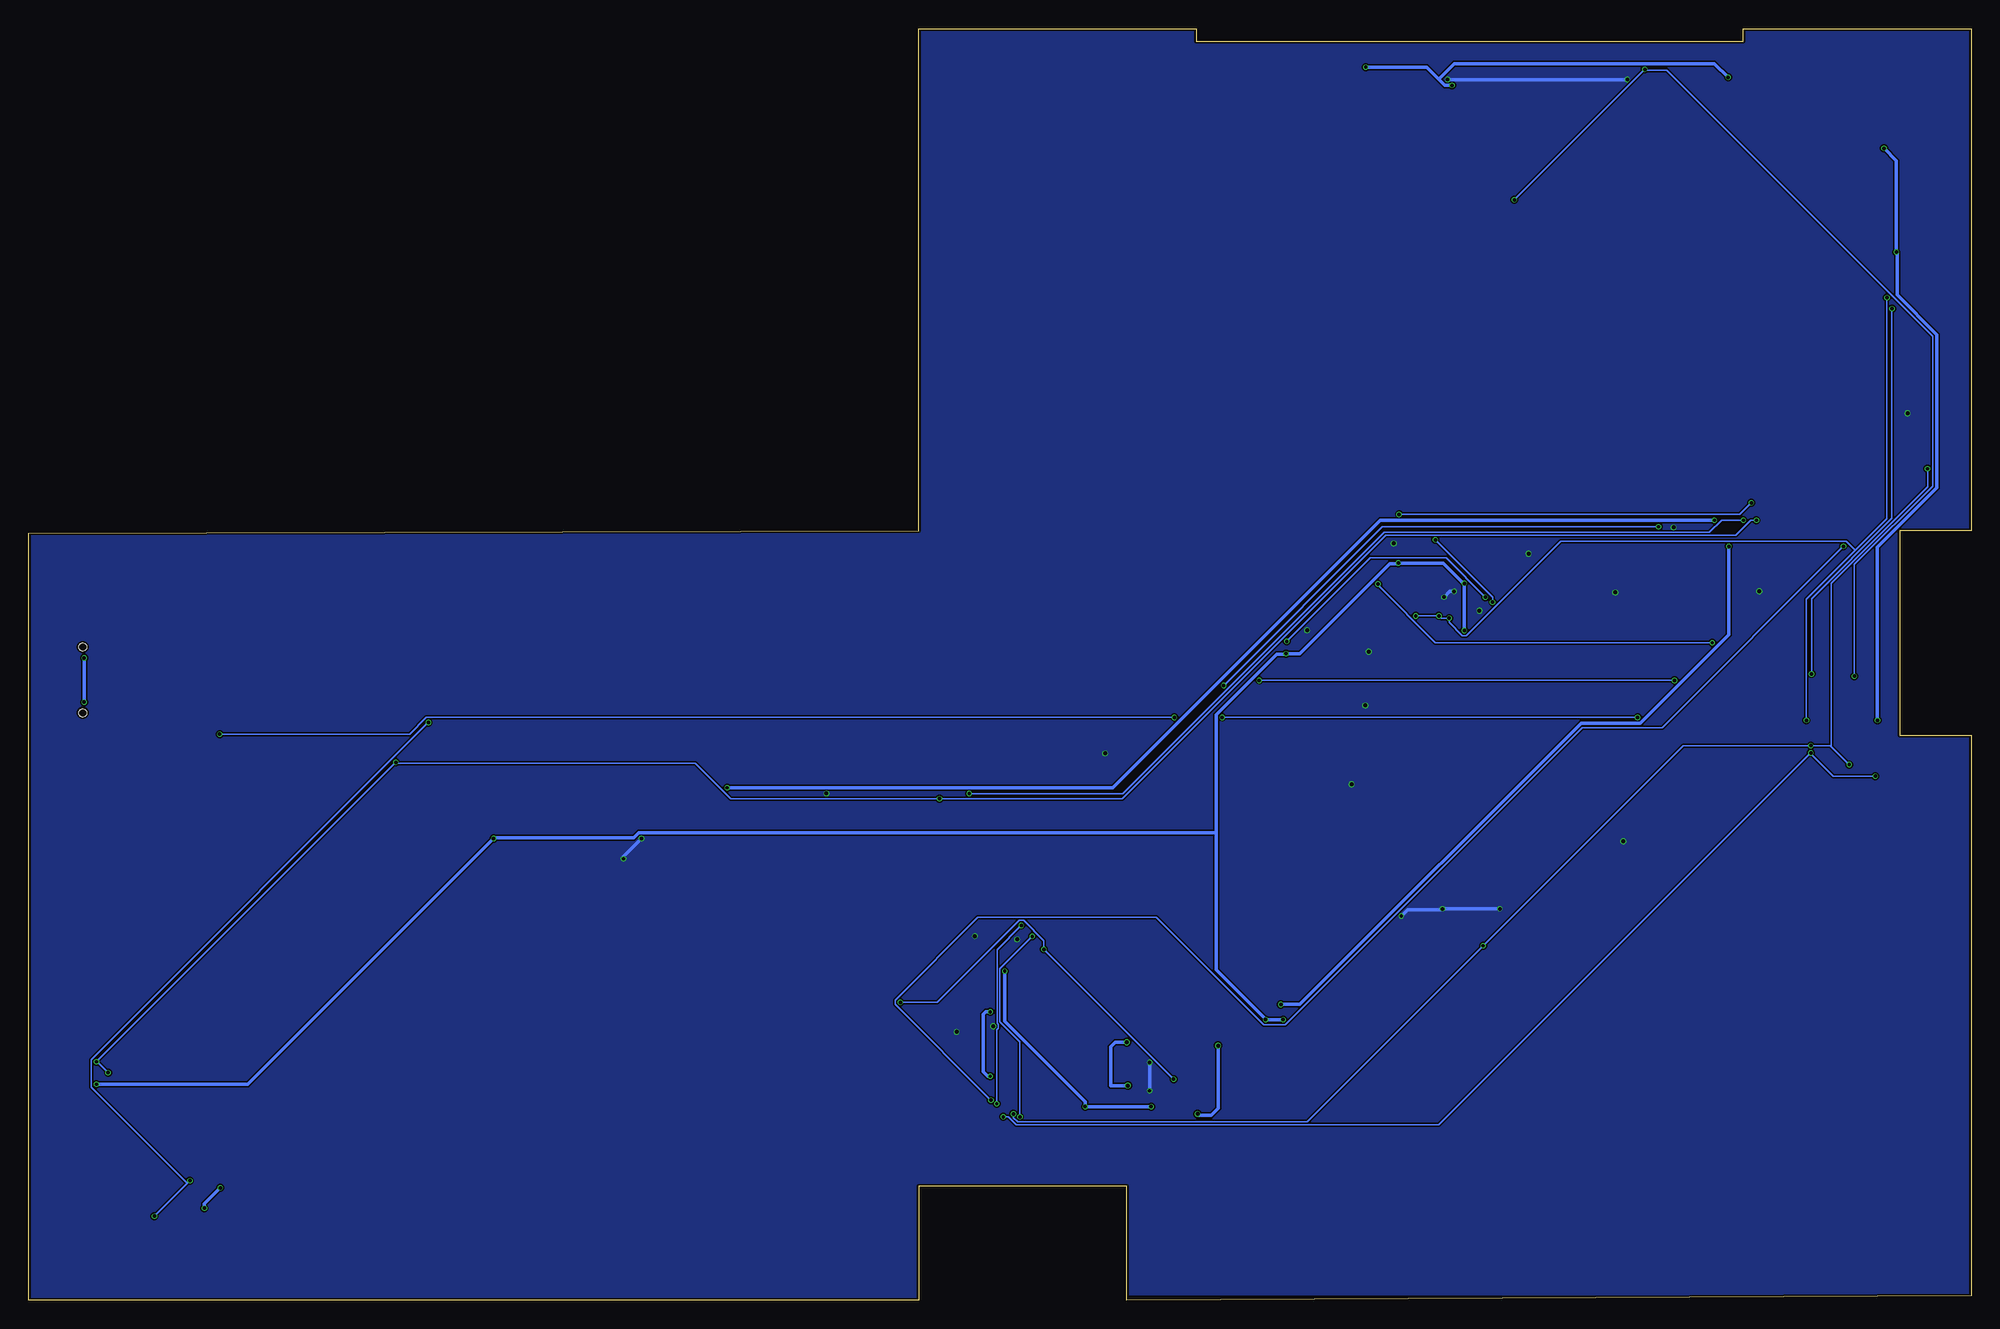
[diagram p2: board, bottom side, seen from below]

Size 170.2 x 111.4 mm. Coordinates in mm from the lower left corner, seen from the top.
Outline: 0,0.4 74,0 74,10 92.2,10 92.2,0 170.2,0 170.2,67.2 92.2,67.4 92.2,111.4 67.9,111.4 67.9,110.3 20,110.3 20,111.4 0,111.4 0,67.4 6.3,67.4 6.3,49.5 0,49.5 0,0.4
Copper layers (1*16): Top 0.035mm / dielectric 1.6mm / Bottom 0.035mm
Design rules "jlcpcb-2layers.dru": minimum track width 5mil, minimum drill 0.3mm, track to track 5mil, track to pad 5mil, pad to pad 5mil, via to via 5mil, smd to smd 5mil, copper to edge 0.2mm, drill to drill 6mil, minimum pad ring 10mil, minimum via ring 3mil, stop-mask expansion 4mil, vias tented up to drill 0mil, thermal gap 10mil

### Footprints (pad centres in the part's own frame; a part is rotated, then mirrored left to right if it is on the bottom)
MYBUTTON = smd 1.4 x 1.05: 1 1.75,0.75; 2 -1.75,0.75; 3 -1.75,-0.75; 4 1.75,-0.75
EAGLE-LTSPICE_C0402 = smd 0.7 x 0.9: 1 -0.65,0; 2 0.65,0
CAPMP3216X180N = smd 1.796 x 1.189: 1 -1.31,0; 2 1.31,0
ESP32_WROVER_EAGLE-LTSPICE_C0402 = smd 0.7 x 0.9: 1 -0.65,0; 2 0.65,0
CAPC1005X60 = smd 0.56 x 0.629: 1 -0.485,0; 2 0.485,0
CAPCP3225X100N = smd 1.4 x 1.4: 1 -1.1,0; 2 1.1,0
ADAFRUIT_CHIP-LED0603 = smd 0.8 x 0.8: A 0,-0.75; C 0,0.75
SOT95P280X145-6N = smd 1.2 x 0.6: 1 -1.25,0.95; 2 -1.25,0; 3 -1.25,-0.95; 4 1.25,-0.95; 5 1.25,0; 6 1.25,0.95
ESP32_WROVER_AVX---SD0805S020S1R0_AVX_SD0805S020S1R0_0 = smd 0.8 x 0.9: 1 -1.05,0; 2 1.05,0
SOD3716X135N = smd 1.15 x 0.8: 1 1.806,0; 2 -1.806,0
DIOC1608X36N = smd 0.97 x 0.94: 1 -0.75,0; 2 0.75,0
SOT95P280X125-5N = smd 0.9 x 0.6: 1 -1.4,0.95; 2 -1.4,0; 3 -1.4,-0.95; 4 1.4,-0.95; 5 1.4,0.95
SOT95P280X120-5N = smd 0.9 x 0.6: 1 -1.4,0.95; 2 -1.4,0; 3 -1.4,-0.95; 4 1.4,-0.95; 5 1.4,0.95
FH34SRJ24S05SH99 = smd 0.3 x 0.8: 1 5.75,1.45; 2 5.25,1.45; 3 4.75,1.45; 4 4.25,1.45; 5 3.75,1.45; 6 3.25,1.45; 7 2.75,1.45; 8 2.25,1.45; 9 1.75,1.45; 10 1.25,1.45; 11 0.75,1.45; 12 0.25,1.45; 13 -0.25,1.45; 14 -0.75,1.45; 15 -1.25,1.45; 16 -1.75,1.45; 17 -2.25,1.45; 18 -2.75,1.45; 19 -3.25,1.45; 20 -3.75,1.45; 21 -4.25,1.45; 22 -4.75,1.45; 23 -5.25,1.45; 24 -5.75,1.45 | smd 0.4 x 0.8: MP1 6.75,-1.05; MP2 -6.75,-1.05
SAMACSYS_PARTS_USB4110GFA = smd 0.3 x 1.15: A1 -3.35,3.678; A4 -2.55,3.678; A5 -1.25,3.678; A6 -0.25,3.678; A7 0.25,3.678; A8 1.25,3.678; A9 2.55,3.678; A12 3.35,3.678; B1 3.05,3.678; B4 2.25,3.678; B5 1.75,3.678; B6 0.75,3.678; B7 -0.75,3.678; B8 -1.75,3.678; B9 -2.25,3.678; B12 -3.05,3.678 | smd 2.18 x 2: MP1 -5.11,-0.827; MP2 5.11,-0.827; MP3 -5.11,3.103; MP4 5.11,3.103 | hole 0.65: -2.89,2.603; 2.89,2.603
JST04_1MM_RA = smd 0.6 x 1.35: 1 -1.5,0; 2 -0.5,0; 3 0.5,0; 4 1.5,0 | smd 1.2 x 2: NC1 2.8,-3.675; NC2 -2.8,-3.675
112ATAARR03ATTEND = smd 1.8 x 1.2: G1 10.6,10.4; G2 4.9,10.4; S1 7.75,10.4; S2 2.05,10.4 | smd 1.4 x 1.9: G3 13.6,-3.85; G4 0.45,-2.85 | smd 0.7 x 1.5: P1 8.8,0; P2 7.7,0.4; P3 6.6,0; P4 5.5,-0.2; P5 4.4,0; P6 3.3,-0.2; P7 2.2,0; P8 1.1,0
IND_4828-WE-TPC_WRE = smd 0.127 x 0.127: 1 -2.286,0 | smd 0.305 x 0.305: 2 2.286,0
ESP32_WROVER_SPARKFUN-IC-POWER_SOT23-5 = smd 0.55 x 1.2: 1 -0.95,-1.3; 2 0,-1.3; 3 0.95,-1.3; 4 0.95,1.3; 5 -0.95,1.3
ESP32C6_VARISTOR_CT/CN1812 = smd 1.5 x 3.6: 1 -2.25,0; 2 2.25,0
ESP32_WROVER_SPARKFUN-DISCRETESEMI_SOT23-3 = smd 0.8 x 0.9: 1 -0.95,-1; 2 0.95,-1; 3 0,1.1
SOT65P210X110-3N = smd 1.05 x 0.5: 1 -1.05,0.65; 2 -1.05,-0.65; 3 1.05,0
RESC1005X40 = smd 0.535 x 0.644: 1 -0.507,0; 2 0.507,0
ESP32_WROVER_EAGLE-LTSPICE_R0402 = smd 0.7 x 0.9: 1 -0.65,0; 2 0.65,0
ESP32_WROVER_BME680_PSON80P300X300X100-8N = smd 1.016 x 0.5: 1 1.458,1.2; 2 1.458,0.4; 3 1.458,-0.4; 4 1.458,-1.2; 5 -1.458,-1.22; 6 -1.458,-0.4; 7 -1.458,0.4; 8 -1.458,1.2
SJ = smd 1.168 x 1.6: 1 -0.762,0; 2 0.762,0
TP20R = smd 2 x 2: TP 0,0
SON127P600X800X80-9N = smd 0.94 x 0.44: 1 -3.895,1.905; 2 -3.895,0.635; 3 -3.895,-0.635; 4 -3.895,-1.905; 5 3.895,-1.905; 6 3.895,-0.635; 7 3.895,0.635; 8 3.895,1.905 | smd 3.4 x 4.3: 9 0,0
XCVR_ESP32-C6-WROOM-1-N8 = smd 1.5 x 0.9: 1 -8.75,5.26; 2 -8.75,3.99; 3 -8.75,2.72; 4 -8.75,1.45; 5 -8.75,0.18; 6 -8.75,-1.09; 7 -8.75,-2.36; 8 -8.75,-3.63; 9 -8.75,-4.9; 10 -8.75,-6.17; 11 -8.75,-7.44; 12 -8.75,-8.71; 13 -8.75,-9.98; 14 -8.75,-11.25; 15 8.75,-11.25; 16 8.75,-9.98; 17 8.75,-8.71; 18 8.75,-7.44; 19 8.75,-6.17; 20 8.75,-4.9; 21 8.75,-3.63; 22 8.75,-2.36; 23 8.75,-1.09; 24 8.75,0.18; 25 8.75,1.45; 26 8.75,2.72; 27 8.75,3.99; 28 8.75,5.26 | smd 0.8 x 0.8: 29_1 -2.755,0.79; 29_2 -1.505,0.79; 29_3 -0.255,0.79; 29_4 -2.755,-0.46; 29_5 -1.505,-0.46; 29_6 -0.255,-0.46; 29_7 -2.755,-1.71; 29_8 -1.505,-1.71; 29_9 -0.255,-1.71
SOIC127P1032X265-16N = smd 2.05 x 0.59: 1 -4.655,4.445; 2 -4.655,3.175; 3 -4.655,1.905; 4 -4.655,0.635; 5 -4.655,-0.635; 6 -4.655,-1.905; 7 -4.655,-3.175; 8 -4.655,-4.445; 9 4.655,-4.445; 10 4.655,-3.175; 11 4.655,-1.905; 12 4.655,-0.635; 13 4.655,0.635; 14 4.655,1.905; 15 4.655,3.175; 16 4.655,4.445
SON50P200X200X80-9N = smd 0.76 x 0.321: 1 -0.985,0.75; 2 -0.985,0.25; 4 -0.985,-0.75; 6 0.985,-0.25 | smd 0.76 x 0.305: 3 -0.985,-0.25 | smd 0.76 x 0.27: 5 0.985,-0.75; 7 0.985,0.25; 8 0.985,0.75 | smd 0.9 x 1.3: 9 0,0

### Placement (x,y rotation side)
BOOT_BUTTON  49,108.7 180 top
C1  154.1,5.3 270 top
C1_BAT  114,50.74 180 top
C1_BAT1  117.2,40.4 90 top
C2  152.8,5.3 270 top
C2_BAT  125.54,50.22 90 top
C2_BAT2  130.3,39.9 270 top
C3  126.34,39.81 270 top
C4  97.61,31.1 269.3 top
C4_USB  151.72,50.37 270 top
C5  27.24,108.54 270 top
C5_USB  159.02,52.73 90 top
C6  52.24,108.7 270 top
C7  81.28,24.24 0 top
C8  89.77,40.56 359 top
C9  8.3,100.88 90 top
C10  67.24,108.72 270 top
C10_SUPERCAP  95.06,43.85 270 top
C_DELAY  48.6,95.43 270 top
CHANGE_BUTTON  64,108.72 180 top
CHG_LED  117.6,50.8 270 top
D1  155.84,50.5 180 top
D2  118.71,40.79 90 top
D3  86.49,34.48 180.9 top
D4  93.43,31.18 0 top
D5  93.47,26.08 180.4 top
D6  49.1,34.3 90 top
D7  87.97,56.59 0 top
D8  38.5,34.3 90 top
D9  45.57,34.3 90 top
D10  42.03,34.3 90 top
D11  47.22,58.33 90 top
D12  15.09,98.92 180 top
EPD_C1  89.6,21 269.8 top
EPD_C2  88,21 268.7 top
EPD_C5  86.3,21 268.7 top
EPD_C6  84.6,21 271 top
EPD_C7  83,21 269.8 top
EPD_C8  81.4,21 90 top
EPD_C9  79.7,21 270.1 top
EPD_C10  78.1,21 268.8 top
EPD_C11  71.2,18.27 269.3 top
EPD_C12  71.4,14.6 359.3 top
IC1  45.63,95.4 0 top
IC4  122.37,40.57 0 top
J1  84.1,13.8 0 top
J2  168.06,54.33 90 top
J3  165.32,19.38 90 top
J4  5,96.15 270 top
L1  85.33,28.45 269.8 top
MCP73831  121.6,49.95 90 top
PFMF.050.14  155.42,42.66 180 top
Q1  127.76,46.31 0 top
Q2  77.58,25.11 270.4 top
Q3  68.44,18.28 89.4 top
R1  18.57,45.87 270 top
R1-PINH  156.7,5.3 90 top
R1_BAT  121.43,46.76 0 top
R1_PINH1  88.03,54.85 0 top
R1_PWRUSB  118.65,37.4 0 top
R2  68.08,11.14 269.7 top
R2-PINH  155.4,5.3 90 top
R2-PINH1  92.7,54.03 90 top
R2-USB  157.55,45.46 0 top
R2-USB1  157.58,46.78 0 top
R2_BAT  117.54,48.96 0 top
R3  65.38,13.24 0 top
R4  72.7,18.28 87.6 top
R5  45.57,30.5 270 top
R6  41.93,30.5 270 top
R7  45.44,58.34 270 top
R8  10.06,100.92 90 top
R9  49.2,30.5 270 top
R10  38.3,30.5 270 top
R_BOOT  45.68,108.71 270 top
R_CAPACITOR  92.75,43.82 90 top
R_CHANGE  60.55,108.71 270 top
R_CL1  74.43,25.16 270 top
R_RESET  20.7,108.51 270 top
RESET_BUTTON  24.01,108.72 180 top
SENSOR2  154.5,10.4 90 top
SJ1  65.1,11 0 top
TP1  13.07,70.82 0 top
TP2  15.68,70.82 0 top
TP3  128.6,49.92 0 top
TP4  28.22,58.02 0 top
TP5  28.24,54.72 0 top
TP6  7.86,70.82 0 top
TP7  12.82,45.87 0 top
TP8  9.79,45.87 0 top
TP9  10.47,70.82 0 top
TP10  21.29,45.87 0 top
TP11  6.77,45.87 0 top
TP12  18.28,70.82 0 top
TP13  20.89,70.82 0 top
TP14  149.04,42.62 0 top
TP15  15.84,45.87 0 top
TP16  3.74,45.87 0 top
TP17  76.59,29.12 0 top
U1  48.13,64.06 0 top
U2  13,58.44 90 top
U3  85.29,47.9 269.5 top
U4  132.64,49.9 0 top

### Tracks (layer width: path | path; a pad name or v marks a point on that pad's centre or on a via)
3V3  (via drill 0.3)
  Top 0.3: 45.38,106.43 45.38,107.76 45.63,108.01 R_BOOT.2 | 45.38,106.43 45.38,96.33 44.49,95.44 44.24,95.44 IC1.2 | v53.06,108.01 60.49,108.01 R_CHANGE.2 | v45.51,106.43 45.38,106.43 | v6.58,91.82 5.44,90.68 4.8,90.68 J4.P4 | v7.66,100.9 8.17,101.41 C9.2 8.36,101.41 9.88,101.41 10.01,101.54 R8.2 10.2,101.6 16.42,107.82 20.68,107.82 R_RESET.2 20.74,107.7 v21.31,107.12 | IC4.5 123.8,41.47 125.96,41.47 126.28,41.15 C3.1 126.47,41.08 126.98,40.58 129.45,40.58 | 129.45,40.58 130.28,40.58 C2_BAT2.1 | v164.25,18.92 165.27,18.92 J3.2 | v129.45,40.45 129.45,40.58 | U3.2 88.56,52.58 88.62,52.64 88.62,54.8 R1_PINH1.2 88.75,54.99 89.7,55.94 | 89.7,55.94 89.7,57.15 89.51,57.34 88.5,57.34 87.8,56.64 86.97,56.64 D7.1 86.78,56.64 v60.05,56.64 | R2-PINH1.2 92.69,54.74 90.97,54.74 89.83,55.88 89.7,55.94 | U1.8 52.05,65.91 52.05,64.71 U1.7 51.92,64.58 v50.2,64.58 | v44.43,58.67 45.38,57.72 R7.2 | v44.43,62.8 44.43,63.18 44.24,63.37 U1.3 | U2.2 9.06,49.66 9.06,49.28 9.69,48.64 9.75,48.64 11.22,47.18 11.22,45.66 12.29,44.58 16.36,44.58 17.12,45.34 18.52,45.34 R1.2 18.71,45.34 19.98,45.34 35.35,29.97 38.2,29.97 R10.2 38.33,29.91 41.89,29.91 R6.2 42.08,29.91 45.51,29.91 R5.2 45.7,29.91 49.19,29.91 R9.2 49.32,29.78 54.52,24.57 v60.3,24.57 | TP16.TP 3.79,45.91 4.99,45.91 7.72,48.64 8.36,48.64 8.93,49.21 U2.2 | Q2.3 78.65,25.08 76.24,25.08 75.67,24.51 74.46,24.51 R_CL1.2 74.34,24.57 v61.83,24.57 | v8.23,50.8 8.93,50.1 8.93,49.78 U2.2
  Bottom 0.3: v53.06,108.01 47.73,108.01 46.68,106.97 | 46.68,106.97 46.14,106.43 v45.51,106.43 | v7.66,100.9 6.58,99.82 v6.58,91.82 6.52,91.69 6.52,88.08 3.02,84.58 3.02,71.18 8.23,65.98 v8.23,50.8 | 46.68,106.97 45.31,108.33 22.52,108.33 v21.31,107.12 | v164.25,18.92 150.98,18.92 v129.45,40.45 129.33,40.51 117.2,40.51 116.75,40.96 66.14,40.96 | v44.43,58.67 v44.43,62.8 44.55,62.87 46.27,64.58 v50.2,64.58 50.33,64.52 50.97,64.52 58.84,56.64 v60.05,56.64 60.17,56.58 60.87,56.58 66.14,51.31 66.14,40.96 | v60.3,24.57 v61.83,24.57 61.89,24.7 66.14,28.96 66.14,40.96
32KHZ  (via drill 0.3)
  Top 0.127: U3.1 89.83,52.58 90.59,53.34 92.69,53.34 R2-PINH1.1 92.75,53.4 93.39,54.04 93.39,55.12 90.78,57.72 v59.98,57.72 | v42.58,61.59 36.81,61.59 28.68,53.47 21.44,53.47 17.95,49.97 17.95,49.72 U2.9
  Bottom 0.127: v42.58,61.59 46.01,65.02 52.68,65.02 v59.98,57.72
DN
  Top 0.127: J2.A7 164.38,54.55 164.95,54.55 165.2,54.29 165.2,53.91 164.89,53.59 164.38,53.59 J2.B7 164.38,53.53 163.81,53.53 159.87,49.59 157.14,49.59 D1.1
DP
  Top 0.127: 163.58,54.32 163.55,54.36 163.55,54.8 163.81,55.05 164.38,55.05 J2.B6 | 163.58,54.32 163.81,54.1 164.38,54.1 J2.A6 | 163.58,54.32 162.09,52.83 158.66,52.83 157.33,51.5 157.14,51.5 D1.3
EPD_3V3  (via drill 0.3)
  Top 0.3: J1.16 82.4,15.3 82.84,15.3 J1.15 82.84,15.43 82.84,16.32 86.05,19.53 | 86.05,19.53 86.27,19.75 86.27,20.32 EPD_C5.2 | 79.42,24.19 80.62,24.19 C7.1 80.75,24.32 82.59,26.16 L1.2 85.57,25.65 v85.95,25.26 | 79.42,24.19 76.62,24.19 Q2.2 | 79.42,24.19 79.42,25.65 76.62,28.45 76.62,29.08 TP17.TP | v85.95,19.62 86.05,19.53
  Bottom 0.3: v85.95,25.26 86.36,25.26 86.56,25.06 86.56,20.02 86.16,19.62 v85.95,19.62
EPD_3V3_C  (via drill 0.3)
  Top 0.3: Q2.1 76.56,26.04 76.37,25.84 74.46,25.84 R_CL1.1 74.34,25.91 v60.49,25.91 | TP13.TP 20.87,70.8 20.49,70.42 20.49,67.25 U2.18 20.49,67.06 20.49,66.8 v21.25,66.04
  Bottom 0.3: v60.49,25.91 58.84,25.91 34.2,50.55 29,50.55 21.25,58.29 v21.25,66.04
EPD_BUSY  (via drill 0.3)
  Top 0.127: v85.89,17.53 85.89,15.3 J1.9 | v11.22,66.04 10.33,66.93 10.33,67.18 U2.26 10.33,67.25 10.45,67.37 10.45,70.8 TP9.TP
  Bottom 0.127: v85.89,17.53 94.27,25.91 94.27,26.29 87.03,33.53 71.41,33.53 62.02,24.13 60.11,24.13 34.08,50.16 27.09,50.16 v11.22,66.04
EPD_CS
  Top 0.127: U2.11 20.49,49.66 20.49,46.67 21.25,45.91 TP10.TP 21.31,45.85 22.52,45.85 37.76,30.61 48.55,30.61 49.12,31.18 R9.1 49.19,31.18 49.19,32.19 48.43,32.96 48.43,34.23 49.12,34.92 D6.2 49.12,34.99 72.43,34.99 79.03,28.38 91.23,28.38 92.94,26.67 92.94,25.46 90.53,23.05 90.53,21.46 90.15,21.08 87.61,21.08 87.29,20.77 87.29,20.26 84.37,17.34 84.37,15.3 J1.12
EPD_DC  (via drill 0.3)
  Top 0.127: v84.81,16.07 84.81,15.3 J1.11 | v14.07,47.94 12.87,49.15 12.87,49.66 U2.5 | v8.42,45.91 6.77,45.91 TP11.TP
  Bottom 0.127: v84.81,16.07 84.37,16.07 83.67,15.37 46.65,15.37 v14.07,47.94 14.07,47.88 12.1,45.91 v8.42,45.91
EPD_RST  (via drill 0.3)
  Top 0.127: v85.38,17.21 85.38,15.3 J1.10 | v83.23,32.83 52.75,63.31 52.75,66.23 v50.14,68.83 | TP12.TP 18.33,70.8 v19.28,69.85 19.15,69.91 16.68,67.44 16.68,67.25 U2.21
  Bottom 0.127: v50.14,68.83 20.3,68.83 v19.28,69.85 | v85.38,17.21 85.38,23.69 85.26,23.82 85.26,24.18 85.36,24.28 85.36,30.7 v83.23,32.83
FLASH_CS
  Top 0.127: R5.1 45.51,31.18 45.51,32.38 44.87,33.02 44.87,34.35 45.51,34.99 D9.2 46.2,35.69 46.2,48.45 | 46.2,48.45 46.2,59.94 45.76,60.39 45.76,64.14 44.24,65.66 44.24,65.91 U1.1 | 46.2,48.45 22.71,48.45 21.76,49.4 21.76,49.66 U2.12
GDR  (via drill 0.35)
  Top 0.3: J1.2 89.32,15.24 89.32,14.73 86.34,11.75 72.37,11.75 v67.79,16.32 67.79,17.21 Q3.1 | R4.2 73.77,18.93 v73.9,18.8 | v74,22.6 66.3,22.6 v66,22.3
  Bottom 0.3: v73.9,18.8 75.4,18.8 75.4,22.2 75,22.6 v74,22.6 | v66,22.3 66,16.8 66.6,16.2 67.67,16.2 v67.79,16.32
GND  (via drill 0.3, 0.35)
  Top 0.3: TP4.TP 28.23,58.04 32.3,62.1 44.17,62.1 U1.4 44.36,62.1 v45.31,62.1 | TP5.TP 28.23,54.74 28.23,57.91 TP4.TP | U2.29_1 12.23,55.69 12.23,56.9 U2.29_2 | U2.29_3 12.23,58.17 12.23,57.02 U2.29_2 | U2.29_1 12.36,55.69 13.44,55.69 U2.29_4 13.56,55.69 U2.29_7 14.71,55.82 14.71,56.9 U2.29_8 | U2.29_5 13.44,56.96 12.36,56.96 U2.29_2 | U2.29_3 12.36,58.23 13.44,58.23 U2.29_6 13.56,58.23 14.71,58.23 U2.29_9 14.84,58.1 28.11,58.1 TP4.TP | U2.1 7.72,49.72 7.72,52.9 10.45,55.63 12.1,55.63 U2.29_1 | U2.29_3 12.1,58.29 7.79,62.61 7.79,67.18 U2.28 7.66,67.31 7.66,68.26 1.25,74.68 1.25,82.42 J4.G3 1.18,82.55 1.18,89.47 4.48,92.77 J4.P6 4.74,92.9 4.55,92.9 2.2,95.25 2.2,95.57 J4.G4 2.2,95.76 6.83,100.39 C9.1 8.42,100.46 8.99,100.46 9.44,100.9 13.95,100.9 15.72,99.12 D12.1 | C10.2 67.22,108.01 65.76,108.01 CHANGE_BUTTON.2 65.64,108.01 62.27,108.01 CHANGE_BUTTON.1 62.14,107.89 61.57,107.89 61.06,107.38 52.94,107.38 52.36,107.95 C6.2 52.24,108.01 50.84,108.01 50.78,107.95 BOOT_BUTTON.2 BOOT_BUTTON.1 47.22,107.82 46.27,106.87 | 46.46,95.06 45.89,94.49 44.24,94.49 IC1.3 | 46.46,95.06 48.3,95.06 48.55,94.81 C_DELAY.2 | 46.27,106.87 46.27,95.95 46.39,95.82 46.39,95.19 46.46,95.06 | D12.1 15.85,98.87 15.85,95.57 16.3,95.12 16.3,92.2 15.41,91.31 J4.G2 15.34,91.12 14.52,90.3 14.52,87.38 15.34,86.55 15.34,85.6 J4.G1 | D12.1 15.85,99.06 22.2,105.41 22.2,107.89 RESET_BUTTON.1 22.27,108.01 25.63,108.01 RESET_BUTTON.2 25.82,107.95 27.22,107.95 C5.2 27.34,107.82 28.23,106.93 v30.14,106.93 | v45.89,106.93 46.14,106.93 46.27,106.87 | D8.1 38.46,33.59 38.46,33.72 37.7,34.48 37.7,35.62 37.89,35.81 39.79,35.81 v41.31,34.29 42.01,33.59 D10.1
  Top 0.3: 46.3,34.32 47.16,35.18 47.16,57.53 D11.1 47.28,57.72 48.11,58.55 48.11,61.59 | 46.3,34.32 45.57,33.59 D9.1 | v46.33,34.29 46.3,34.32 | 48.11,61.59 48.11,64.01 U1.9 | EPD_C8.1 81.45,20.38 81.76,20.38 82.97,21.59 EPD_C7.1 83.1,21.65 84.56,21.65 EPD_C6.1 84.69,21.65 85.38,21.65 | 85.38,21.65 86.27,21.65 EPD_C5.1 86.46,21.65 87.92,21.65 EPD_C2.1 88.05,21.65 89.58,21.65 EPD_C1.1 89.64,21.78 89.64,22.67 92.56,25.59 92.56,26.54 92.31,26.8 89.51,26.8 86.91,24.19 82.08,24.19 C7.2 81.89,24.19 81.89,23.94 79.73,21.78 EPD_C9.1 79.67,21.65 78.14,21.65 EPD_C10.1 78.02,21.65 71.98,21.65 | 81.83,14.73 79.86,12.76 77.38,12.76 J1.MP2 | 81.83,14.73 81.83,15.24 J1.17 81.89,15.37 81.89,16 85.38,19.49 85.38,21.65 | J1.8 86.34,15.24 86.34,14.73 86.15,14.54 82.08,14.54 81.95,14.67 81.83,14.73 | EPD_C12.1 70.72,14.67 70.46,14.67 68.49,16.64 68.49,17.84 68.87,18.22 70.53,18.22 71.16,18.86 EPD_C11.1 71.35,18.92 71.95,18.32 | 71.95,18.32 72.62,17.65 R4.1 | 49.95,33.53 52.11,33.53 64.05,21.59 | 49.95,33.53 49.12,33.53 D6.1 | 64.05,13.97 64.05,11.3 64.3,11.05 SJ1.1 | 64.05,13.97 64.05,21.59 | 71.98,21.65 64.17,21.65 64.05,21.59 | 71.98,21.65 v71.98,20.83 | 71.95,18.32 v71.98,18.35 | 64.05,13.97 65.25,13.97 65.38,13.84 65.38,12.64 65.51,12.51 66.14,12.51 66.78,11.87 67.98,11.87 R2.1 68.11,11.75 68.56,11.3 86.53,11.3 87.92,12.7 90.84,12.7 J1.MP1 90.91,12.89 90.91,22.92 93.32,25.34 93.32,30.86 90.4,33.78 85.45,33.78 84.81,34.42 D3.1 84.69,34.48 84.69,35.56 88.5,39.37 88.56,39.5 | v49.95,33.66 49.95,33.53 | 88.56,39.5 89.64,39.5 90.4,40.26 90.4,40.51 C8.2 90.53,40.64 94.78,40.64 96.05,41.91 96.05,43.56
  Top 0.3: 88.56,39.5 85.89,42.16 85.89,43.18 U3.13 | 96.05,43.56 95.1,44.51 95.1,44.9 C10_SUPERCAP.1 | C2_BAT2.2 130.28,39.24 127.04,39.24 126.34,38.54 C3.2 126.21,38.61 122.09,38.61 121.83,38.86 121.71,38.92 | 121.71,38.92 119.55,36.77 118.72,36.77 118.15,37.34 R1_PWRUSB.1 118.09,37.53 v118.09,38.67 | 121.71,38.92 121.71,40.07 121.26,40.51 121.01,40.51 IC4.2 | 117.2,45.97 117.2,48.7 116.94,48.96 R2_BAT.1 | 117.2,45.97 117.2,41.08 C1_BAT1.2 117.07,41.02 v116.5,40.45 | U4.9 132.63,49.85 132.63,49.72 132.06,49.15 131.67,49.15 U4.4 131.55,49.09 130.72,49.09 128.31,46.67 127.23,46.67 125.64,48.26 | U4.1 131.67,50.67 132.06,50.67 132.69,50.04 U4.9 | U4.9 132.75,49.66 133.58,49.66 U4.6 133.77,49.66 134.72,49.66 137.77,46.61 147.04,46.61 150.85,50.42 150.98,50.48 | 125.64,48.26 125.64,49.47 C2_BAT.1 125.52,49.59 123.23,49.59 122.91,49.91 MCP73831.2 122.78,50.04 122.47,50.04 120.56,51.94 114.66,51.94 113.51,50.8 113.39,50.8 C1_BAT.2 113.26,50.67 106.21,43.62 96.18,43.62 96.05,43.56 | 117.2,45.97 123.29,45.97 125.52,48.2 125.64,48.26 | C1.2 154.09,4.7 152.82,4.7 C2.2 152.69,4.76 152.06,5.4 152.06,6.54 154.03,8.51 154.03,8.83 SENSOR2.7 154.15,8.95 154.15,9.34 154.6,9.78 | 154.6,9.78 155.23,9.78 155.68,9.34 155.68,8.95 SENSOR2.5 155.81,9.4 164.25,17.84 | SENSOR2.1 153.33,11.81 153.33,11.11 154.53,9.91 154.6,9.78 | 164.25,17.84 165.27,17.84 J3.1 | J2.B12 J2.A1 164.44,50.86 164.44,49.78 164.95,49.28 J2.MP3 164.31,49.72 160.12,45.53 158.34,45.53 R2-USB.2 158.22,45.47 156.95,46.74 R2-USB1.1 156.82,46.67 156.25,46.1 156.25,41.08 156.76,40.58 160.19,40.58
  Top 0.3: 150.98,50.48 151.68,49.78 C4_USB.2 | 150.98,50.48 150.98,51.5 151.17,51.69 152.69,51.69 153.84,50.55 154.53,50.55 D1.5 154.73,50.55 154.98,50.55 155.49,51.05 155.49,51.18 157.65,53.34 158.98,53.34 C5_USB.2 159.11,53.47 159.81,53.47 163.68,57.34 164.25,57.34 J2.B1 J2.A12 164.44,57.78 164.44,58.93 J2.MP4 165.08,59.37 168.76,59.37 J2.MP2 168.89,49.28 J2.MP1 168.76,49.15 160.19,40.58 | 164.25,17.84 164.19,17.97 164.19,18.22 163.74,18.67 163.74,36.96 160.25,40.45 160.19,40.58 | 48.11,61.59 v46.2,61.59
  Bottom 0.3: v30.14,106.93 v45.89,106.93 | v41.31,34.29 v46.33,34.29 46.46,34.23 49.38,34.23 v49.95,33.66 | v71.98,20.83 v71.98,18.35 | v118.09,38.67 118.09,38.86 v116.5,40.45 | v45.31,62.1 45.7,62.1 v46.2,61.59
  other vias: 54.3,45.2 31.2,62 52.8,56.8 53.1,52.1 18.6,62.1 30.5,40.2 5.6,77.7 58.2,58.7 75.9,47.9 87.3,31.9 88.9,23.5 83.6,31.6 85.7,24 50.6,66.3 43.1,60.4 26.1,67.7 100.3,44.4 38.8,65.4
  pour Top: 73.96,10.06 73.98,10.08 92.22,10.08 92.24,10.06 92.26,10.04 92.28,10.02 92.28,0.08 170.12,0.08 170.12,67.12 92.18,67.12 92.16,67.14 92.14,67.16 92.12,67.18 92.12,111.32 67.98,111.32 67.98,110.28 67.96,110.26 67.94,110.24 67.92,110.22 19.98,110.22 19.96,110.24 19.94,110.26 19.92,110.28 19.92,111.32 0.08,111.32 0.08,67.48 6.32,67.48 6.34,67.46 6.36,67.44 6.38,67.42 6.38,49.48 6.36,49.46 6.34,49.44 6.32,49.42 0.08,49.42 0.08,0.48 73.92,0.48 73.92,10.02 73.94,10.04
  pour Bottom: 73.96,10.06 73.98,10.08 92.22,10.08 92.24,10.06 92.26,10.04 92.28,10.02 92.28,0.08 170.12,0.08 170.12,67.12 92.18,67.12 92.16,67.14 92.14,67.16 92.12,67.18 92.12,111.32 67.98,111.32 67.98,110.28 67.96,110.26 67.94,110.24 67.92,110.22 19.98,110.22 19.96,110.24 19.94,110.26 19.92,110.28 19.92,111.32 0.08,111.32 0.08,67.48 6.32,67.48 6.34,67.46 6.36,67.44 6.38,67.42 6.38,49.48 6.36,49.46 6.34,49.44 6.32,49.42 0.08,49.42 0.08,0.48 73.92,0.48 73.92,10.02 73.94,10.04
GPIO8
  Top 0.127: R1.1 18.58,46.42 18.58,49.09 19.15,49.66 U2.10
I2C_PW  (via drill 0.3)
  Top 0.3: C2.1 152.82,5.97 154.09,5.97 C1.1 154.22,5.97 154.92,5.97 | 154.92,5.97 155.36,5.97 R2-PINH.2 155.55,5.97 156.69,5.97 R1-PINH.2 | 154.92,5.97 154.92,8.06 | 154.92,8.06 154.92,8.89 SENSOR2.6 | 153.26,9.84 153.26,10.54 152.76,11.05 152.76,12.45 | 153.26,9.84 153.26,8.95 SENSOR2.8 | 152.76,12.45 153.01,12.7 153.58,12.7 154.09,12.19 154.09,11.87 SENSOR2.2 | v22.52,68.33 21.76,67.56 21.76,67.25 U2.17 | v109.01,44.9 141.39,12.51 152.63,12.51 152.76,12.45 | v154.79,8.06 154.92,8.06 | v153.39,9.84 153.26,9.84
  Bottom 0.3: v22.52,68.33 51.79,68.33 75.22,44.9 v109.01,44.9 | v154.79,8.06 154.79,8.45 v153.39,9.84
INT_RTC  (via drill 0.3)
  Top 0.127: 87.35,54.29 87.35,52.64 87.29,52.58 U3.3 | 87.35,54.29 87.35,54.8 R1_PINH1.1 | TP15.TP 15.85,45.91 16.61,46.67 16.61,49.66 U2.8 16.68,49.72 16.68,49.97 20.99,54.29 v26.01,54.29 | v62.4,54.29 87.35,54.29
  Bottom 0.127: v26.01,54.29 v62.4,54.29
IO/BOOT
  Top 0.127: C6.1 52.24,109.41 50.78,109.41 BOOT_BUTTON.3 50.71,109.47 47.28,109.47 BOOT_BUTTON.4 47.22,109.41 45.7,109.41 R_BOOT.1 45.63,109.35 24.3,88.01 24.3,67.25 U2.15
IO/CHANGE
  Top 0.127: R_CHANGE.1 60.55,109.41 62.14,109.41 62.21,109.47 CHANGE_BUTTON.4 62.27,109.47 65.7,109.47 CHANGE_BUTTON.3 65.76,109.47 65.83,109.41 67.22,109.41 C10.1 67.29,109.35 67.92,108.71 67.92,107.63 25.88,65.6 15.47,65.6 14.14,66.93 14.14,67.18 U2.23
MISO
  Top 0.127: D12.2 14.33,98.93 12.99,100.27 10.07,100.27 R8.1 10.07,100.2 10.07,98.74 5.31,93.98 5.06,93.98 J4.P7 5.37,93.98 5.37,93.66 7.85,91.19 7.85,70.87 TP6.TP 7.91,70.8 7.91,68.52 8.99,67.44 8.99,67.25 U2.27 9.06,67.18 9.06,66.93 11.28,64.71 44.17,64.71 U1.2
MOSI  (via drill 0.3)
  Top 0.127: TP7.TP 12.87,45.91 15.34,48.39 15.34,49.66 U2.7 15.34,49.72 15.34,49.91 v14.45,50.8 | v7.41,87.82 5.69,89.53 5.06,89.53 J4.P3 | v45.76,59.75 45.44,59.44 45.44,59.05 R7.1 | v46.65,59.94 46.65,59.63 47.16,59.12 D11.2 | v83.35,16.07 83.35,15.3 J1.14 | v82.27,31.88 52.05,62.1 U1.5 51.98,62.1 49.82,59.94 v48.68,59.94
  Bottom 0.127: v7.41,87.82 7.41,68.45 10.17,65.69 | 10.17,65.69 14.45,61.4 v14.45,50.8 | v48.68,59.94 v46.65,59.94 46.46,59.75 v45.76,59.75 45.76,59.37 44.62,58.23 44.24,58.23 35.98,66.48 10.96,66.48 10.17,65.69 | v82.27,31.88 85.1,29.05 85.1,24.39 83.35,22.64 v83.35,16.07
N$1
  Top 0.127: 118.63,41.37 118.66,41.4 118.66,41.78 D2.2 | 118.63,41.37 117.26,40.01 117.26,39.75 C1_BAT1.1 | 120.34,40.99 120.82,41.47 120.94,41.47 IC4.1 121.01,41.53 121.52,42.04 124.69,42.04 127.93,45.28 128.69,45.28 Q1.2 | 120.34,40.99 120.31,40.96 120.31,40.2 120.44,40.07 120.5,40.07 120.94,39.62 IC4.3 | 120.34,40.99 119.99,41.34 118.66,41.34 118.63,41.37
N$3
  Top 0.127: C4.1 97.58,31.69 95.73,31.69 95.29,31.24 D4.1 95.23,31.24 91.99,34.48 88.31,34.48 D3.2
N$4
  Top 0.127: R2-USB.1 156.95,45.4 157.14,45.4 157.77,44.77 162.92,44.77 166.16,48.01 166.16,54.8 164.89,56.07 J2.B5
N$5
  Top 0.127: R1_BAT.2 122.09,46.8 122.09,48.2 122.85,48.96 MCP73831.1
N$6
  Top 0.127: CHG_LED.C 119.23,50.8 120.56,49.47 121.01,49.47 121.13,49.34 121.13,47.12 120.82,46.8 R1_BAT.1
N$8
  Top 0.127: R2_BAT.2 118.21,48.96 120.25,48.96 MCP73831.5
N$9
  Top 0.127: D7.2 89,56.58 89,56.26 87.92,55.18 87.92,45.59 86.65,44.32 86.65,41.91 88.69,39.88 89.51,39.88 89.83,40.2 89.83,41.08 91.86,43.12 92.75,43.12 R_CAPACITOR.1
N$10
  Top 0.127: R2-USB1.2 158.28,46.8 158.28,47.5 163.81,53.02 164.38,53.02 J2.A5
N$11
  Top 0.127: J1.5 87.86,15.3 87.86,20.26 87.92,20.32 EPD_C2.2
N$12
  Top 0.127: J1.4 88.37,15.3 88.37,19.11 89.58,20.32 EPD_C1.2
N$13
  Top 0.127: R10.1 38.33,31.18 38.33,32.13 39.22,33.02 39.22,34.29 38.52,34.99 D8.2
N$14
  Top 0.127: C_DELAY.1 48.55,96.14 47.22,96.14 47.03,96.33 IC1.5
N$15
  Top 0.3: J1.24 78.34,15.24 72.75,15.24 72.11,14.61 EPD_C12.2
N$16
  Top 0.127: J1.18 81.38,15.3 81.38,17.14 84.56,20.32 EPD_C6.2
N$17
  Top 0.127: J1.19 80.88,15.3 80.88,18.22 82.97,20.32 EPD_C7.2
N$18
  Top 0.127: J1.22 79.29,15.3 79.29,19.18 78.14,20.32 EPD_C10.2
N$20
  Top 0.127: J1.20 80.37,15.3 80.37,20.57 81.38,21.59 EPD_C8.2
PREVGH
  Top 0.127: J1.21 79.8,15.3 79.8,20.26 79.73,20.32 EPD_C9.2 79.73,20.38 80.37,21.02 80.37,21.72 80.88,22.23 85.45,22.23 89.26,26.04 91.61,26.04 D5.1
PREVGL  (via drill 0.3)
  Top 0.3: v77.64,16.95 78.84,15.75 78.84,15.3 J1.23 | v71.86,16.95 71.22,17.59 EPD_C11.2 | v84.69,28.83 88.05,28.83 90.4,31.18 91.61,31.18 D4.2
  Bottom 0.3: v71.86,16.95 v77.64,16.95 77.64,17.4 84.69,24.45 v84.69,28.83
RESE
  Top 0.127: 71.32,15.14 69.25,17.21 69.13,17.21 Q3.2 | 71.32,15.14 71.35,15.11 71.35,14.16 73.38,12.13 86.08,12.13 88.81,14.86 88.81,15.24 J1.3 | R3.2 66.08,13.27 66.08,16.64 68.05,18.61 69.76,18.61 70.65,19.49 73.83,19.49 74.34,18.98 74.34,18.17 71.32,15.14
RESE'
  Top 0.127: R3.1 64.75,13.21 64.75,12.26 65.83,11.18 65.83,11.05 SJ1.2 65.89,10.99 66.33,10.54 68.05,10.54 R2.2
RESET  (via drill 0.3)
  Top 0.127: R_RESET.1 20.74,109.22 21.95,109.22 22.2,109.47 RESET_BUTTON.4 RESET_BUTTON.3 25.82,109.47 26.07,109.22 27.22,109.22 C5.1 27.28,109.16 v28.61,107.82 | v40.05,96.39 44.17,96.39 IC1.1 | v10.26,54.67 10.26,49.72 U2.3
  Bottom 0.127: v40.05,96.39 v28.61,107.82 28.61,107.76 26.71,107.76 3.4,84.45 3.4,71.31 10.26,64.45 v10.26,54.67
RTC_RST  (via drill 0.3)
  Top 0.127: v27.41,67.75 25.88,66.23 23.73,66.23 23.03,66.93 23.03,67.18 U2.16 | v65.51,53.85 85,53.85 85.95,52.9 85.95,52.58 U3.4
  Bottom 0.127: v27.41,67.75 51.6,67.75 v65.51,53.85
RX
  Top 0.127: U2.24 12.87,67.25 12.87,68.01 15.66,70.8 TP2.TP
SCK  (via drill 0.3)
  Top 0.127: v14.07,48.58 14.07,49.66 U2.6 | v10.71,46.93 10.71,46.8 9.82,45.91 TP8.TP | v3.85,72.83 3.85,91.12 4.42,91.69 4.99,91.69 J4.P5 | v83.92,16.32 83.86,16.26 83.86,15.3 J1.13 | 42.71,31.05 42.01,31.05 41.95,31.11 R6.1 | 42.71,31.05 42.71,34.1 42.08,34.73 42.08,34.99 D10.2 | 42.71,31.05 v42.78,31.05
  Bottom 0.127: v10.71,46.93 12.33,48.55 | 12.33,48.55 12.36,48.58 v14.07,48.58 25.25,48.58 v42.78,31.05 58.21,15.62 83.54,15.62 83.92,16 v83.92,16.32 | v3.85,72.83 3.85,71.25 12.29,62.8 12.29,48.58 12.33,48.55
SCL  (via drill 0.3)
  Top 0.127: v138.03,47.12 135.04,50.1 133.64,50.1 U4.7 | v164.25,20.89 165.27,20.89 J3.4 165.33,20.83 165.65,20.83 166.47,20 166.47,13.34 157.2,4.06 156.19,4.06 155.61,4.64 155.42,4.64 R2-PINH.1 | v163.23,19.94 155.74,12.45 155.74,11.87 SENSOR2.4 | v18.84,68.33 17.95,67.44 17.95,67.25 U2.20 | v90.4,43.94 89.7,43.24 U3.16
  Bottom 0.127: v163.23,19.94 164.19,20.89 v164.25,20.89 v138.03,47.12 138.03,47.05 111.8,47.05 108.69,43.94 v90.4,43.94 74.4,43.94 51.31,67.03 26.41,67.03 26.39,67 20.67,67 19.34,68.33 v18.84,68.33
SDA  (via drill 0.3)
  Top 0.127: 159.2,7.33 166.22,14.35 166.22,19.24 165.58,19.88 J3.3 | 159.2,7.33 156.76,4.89 156.76,4.7 R1-PINH.1 | v156.06,10.48 154.92,11.62 154.92,11.81 SENSOR2.3 | v159.17,7.37 159.2,7.33 | 88.56,43.62 88.43,43.5 88.43,43.24 U3.15 88.56,43.62 | 88.56,43.62 97.26,52.32 131.61,52.32 133.26,50.67 133.58,50.67 U4.8 133.64,50.61 v135.17,50.61 | v19.98,68.33 19.22,67.56 19.22,67.25 U2.19 | 88.56,43.62 v87.8,44.39
  Bottom 0.127: v159.17,7.37 156.28,10.26 | 156.28,10.26 v156.06,10.48 | v19.98,68.33 21.88,68.33 22.95,67.26 26.28,67.26 26.31,67.28 51.44,67.28 74.34,44.39 v87.8,44.39 | 156.28,10.26 164.69,18.67 164.69,21.08 v135.17,50.61
SRC  (via drill 0.3)
  Top 0.127: C4.2 97.58,30.42 97.58,28.38 D5.2 95.23,26.1 v93.83,26.1 | v69.89,19.37 68.49,19.37 Q3.3 | v81.26,30.73 85.32,30.73 L1.1
  Bottom 0.127: v69.89,19.37 v81.26,30.73 81.26,31.5 83.03,33.27 83.42,33.27 90.59,26.1 v93.83,26.1
SS_SD  (via drill 0.3)
  Top 0.127: v51.98,62.74 51.98,63.37 U1.6 | v22.71,57.59 19.22,57.59 15.25,53.63 | 15.25,53.63 11.6,49.97 11.6,49.72 U2.4 | v6.96,86.87 5.44,88.39 J4.P2 | 15.25,53.63 v14.01,54.86
  Bottom 0.127: v51.98,62.74 51.98,62.61 46.97,57.59 v22.71,57.59 | v6.96,86.87 6.96,68.52 14.01,61.47 v14.01,54.86
TX
  Top 0.127: U2.25 11.6,67.25 11.6,69.34 13.06,70.8 TP1.TP
USB_D+  (via drill 0.3)
  Top 0.127: v46.97,66.61 49.63,69.28 50.33,69.28 52.62,66.99 137.9,66.99 153.39,51.5 154.53,51.5 D1.4 | v41.95,61.15 36.74,61.15 25.31,49.72 24.3,49.72 U2.14
  Bottom 0.127: v46.97,66.61 41.95,61.59 v41.95,61.15
USB_D-  (via drill 0.3)
  Top 0.127: v153.46,49.59 154.53,49.59 D1.6 | v65.64,51.05 v69.83,51.05 | v29.25,51.05 27.09,51.05 24.74,48.7 23.73,48.7 23.03,49.4 23.03,49.66 U2.13
  Bottom 0.127: v153.46,49.59 136.82,49.59 135.36,51.05 v69.83,51.05 | v29.25,51.05 v65.64,51.05
VBAT
  Top 0.3: MCP73831.3 122.91,50.93 125.52,50.93 C2_BAT.2 125.64,50.8 126.09,50.8 127.67,49.21 127.8,49.15 | 131.67,49.91 131.67,50.1 U4.2 | 131.67,49.91 131.67,49.66 U4.3 | 127.8,49.15 127.8,47.43 Q1.3 | 127.8,49.15 128.56,49.91 TP3.TP 128.75,49.91 131.67,49.91
VBUS
  Top 0.3: R1_PWRUSB.2 119.1,37.4 119.1,39.31 118.72,39.69 D2.1 118.59,39.62 118.28,39.62 117.77,39.12 117.58,39.12 | 115.99,50.8 114.66,50.8 C1_BAT.1 | 115.99,50.8 CHG_LED.A 116.94,50.86 117.58,51.5 119.04,51.5 119.61,50.93 120.25,50.93 MCP73831.4 | 117.58,39.12 116.63,39.12 115.99,39.75 115.99,50.8 | 153.33,48.96 152.95,49.34 152.95,49.78 151.74,50.99 C4_USB.1 | 153.33,48.96 155.3,48.96 156.19,49.85 156.19,49.97 156.69,50.48 157.07,50.48 D1.2 157.2,50.55 157.52,50.55 158.03,51.05 158.03,51.12 158.98,52.07 C5_USB.1 | 131.04,46.04 145.65,46.04 149.01,42.67 TP14.TP 149.14,42.67 153.14,42.67 PFMF.050.14.2 153.26,42.74 153.26,48.83 153.33,48.96 | 131.04,46.04 128.18,46.04 127.48,45.34 126.85,45.34 Q1.1 | 117.58,39.12 117.58,36.96 118.21,36.32 128.56,36.32 131.04,38.8 131.04,46.04
VRTC
  Top 0.127: 92.75,44.45 93.39,44.45 95.04,42.8 C10_SUPERCAP.2 | U3.14 87.16,43.18 87.16,42.86 89.07,40.96 89.07,40.58 C8.1 89.07,41.02 92.5,44.45 92.75,44.45 | 92.75,44.45 R_CAPACITOR.2
VUSB  (via drill 0.3)
  Top 0.3: J2.A4 J2.B9 164.5,52.13 165.08,52.13 v165.33,52.39 | J2.A9 J2.B4 164.5,56.52 165.08,56.52 v165.33,56.26 165.39,56.13 166.54,54.99 166.54,47.88 161.33,42.67 157.71,42.67 PFMF.050.14.1
  Bottom 0.3: v165.33,56.26 v165.33,52.39